# Altium project mainboard.PrjPcb
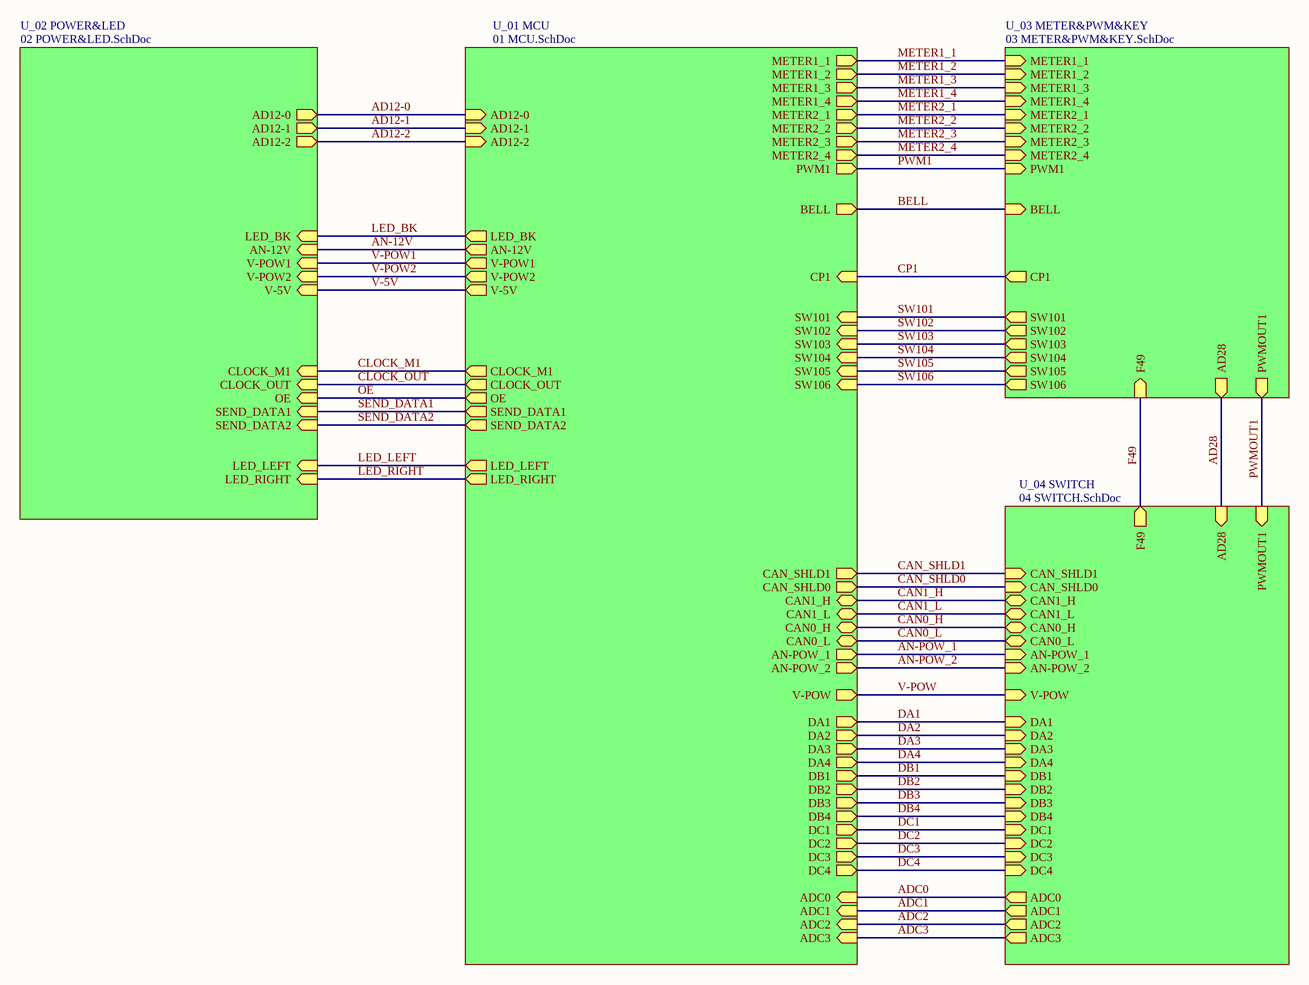
[diagram p0: SCH-MB202-00.SchDoc]
5 sheets, 493 parts. Net scope: hierarchical (ports join the sheet entries above them; power ports are global).
Board files: PCB-MB202-00.PcbDoc, PCB1.PcbDoc
Sheets:
  SCH-MB202-00.SchDoc
    U_01 MCU = 01 MCU.SchDoc
    U_03 METER&PWM&KEY = 03 METER&PWM&KEY.SchDoc
    U_04 SWITCH = 04 SWITCH.SchDoc
    U_02 POWER&LED = 02 POWER&LED.SchDoc

## Sheet SCH-MB202-00.SchDoc
size A3

### Sub-sheets
U_01 MCU = 01 MCU.SchDoc: METER1_1 (out), METER1_2 (out), METER1_3 (out), METER1_4 (out), METER2_1 (out), METER2_2 (out), METER2_3 (out), METER2_4 (out), SW101 (in), SW102 (in), SW103 (in), SW104 (in), CP1 (in), DA1 (out), DA2 (out), DA3 (out), DA4 (out), DB1 (out), DB2 (out), DB3 (out), DB4 (out), DC1 (out), DC2 (out), DC3 (out), DC4 (out), ADC0 (in), ADC1 (in), ADC2 (in), ADC3 (in), LED_BK (out), PWM1 (out), V-POW (out), AN-POW_1 (out), V-5V (out), CAN_SHLD1 (out), CAN1_H (bidir), CAN1_L (bidir), CAN_SHLD0 (out), CAN0_H (bidir), CAN0_L (bidir), V-POW1 (out), V-POW2 (out), AD12-1 (in), AD12-2 (in), AN-12V (out), AN-POW_2 (out), AD12-0 (in), CLOCK_M1 (out), CLOCK_OUT (out), SEND_DATA1 (out), OE (out), SEND_DATA2 (out), BELL (out), LED_RIGHT (out), LED_LEFT (out), SW105 (in), SW106 (in)
U_02 POWER&LED = 02 POWER&LED.SchDoc: LED_BK (in), AD12-0 (out), AN-12V (in), AD12-1 (out), V-POW1 (in), AD12-2 (out), V-POW2 (in), V-5V (in), CLOCK_M1 (in), CLOCK_OUT (in), SEND_DATA1 (in), OE (in), SEND_DATA2 (in), LED_LEFT (in), LED_RIGHT (in)
U_03 METER&PWM&KEY = 03 METER&PWM&KEY.SchDoc: METER1_1 (in), METER1_2 (in), METER1_3 (in), METER1_4 (in), METER2_1 (in), METER2_2 (in), METER2_3 (in), METER2_4 (in), SW101 (out), SW102 (out), SW103 (out), SW104 (out), PWM1 (in), PWMOUT1 (out), AD28 (out), CP1 (out), F49 (in), BELL (in), SW105 (out), SW106 (out)
U_04 SWITCH = 04 SWITCH.SchDoc: F49 (out), PWMOUT1 (in), CAN0_H (bidir), CAN_SHLD0 (in), CAN0_L (bidir), CAN1_L (bidir), CAN1_H (bidir), CAN_SHLD1 (in), AN-POW_1 (in), AN-POW_2 (in), V-POW (in), ADC0 (out), ADC1 (out), ADC2 (out), ADC3 (out), DA1 (in), DA2 (in), DA3 (in), DA4 (in), DB1 (in), DB2 (in), DB3 (in), DB4 (in), DC1 (in), DC2 (in), DC3 (in), DC4 (in), AD28 (in)

### Nets
AD12-0: sheet U_01 MCU/AD12-0, sheet U_02 POWER&LED/AD12-0
AD12-1: sheet U_01 MCU/AD12-1, sheet U_02 POWER&LED/AD12-1
AD12-2: sheet U_01 MCU/AD12-2, sheet U_02 POWER&LED/AD12-2
AD28: sheet U_03 METER&PWM&KEY/AD28, sheet U_04 SWITCH/AD28
ADC0: sheet U_01 MCU/ADC0, sheet U_04 SWITCH/ADC0
ADC1: sheet U_01 MCU/ADC1, sheet U_04 SWITCH/ADC1
ADC2: sheet U_01 MCU/ADC2, sheet U_04 SWITCH/ADC2
ADC3: sheet U_01 MCU/ADC3, sheet U_04 SWITCH/ADC3
AN-12V: sheet U_01 MCU/AN-12V, sheet U_02 POWER&LED/AN-12V
AN-POW_1: sheet U_01 MCU/AN-POW_1, sheet U_04 SWITCH/AN-POW_1
AN-POW_2: sheet U_01 MCU/AN-POW_2, sheet U_04 SWITCH/AN-POW_2
BELL: sheet U_01 MCU/BELL, sheet U_03 METER&PWM&KEY/BELL
CAN0_H: sheet U_01 MCU/CAN0_H, sheet U_04 SWITCH/CAN0_H
CAN0_L: sheet U_01 MCU/CAN0_L, sheet U_04 SWITCH/CAN0_L
CAN1_H: sheet U_01 MCU/CAN1_H, sheet U_04 SWITCH/CAN1_H
CAN1_L: sheet U_01 MCU/CAN1_L, sheet U_04 SWITCH/CAN1_L
CAN_SHLD0: sheet U_01 MCU/CAN_SHLD0, sheet U_04 SWITCH/CAN_SHLD0
CAN_SHLD1: sheet U_01 MCU/CAN_SHLD1, sheet U_04 SWITCH/CAN_SHLD1
CLOCK_M1: sheet U_01 MCU/CLOCK_M1, sheet U_02 POWER&LED/CLOCK_M1
CLOCK_OUT: sheet U_01 MCU/CLOCK_OUT, sheet U_02 POWER&LED/CLOCK_OUT
CP1: sheet U_01 MCU/CP1, sheet U_03 METER&PWM&KEY/CP1
DA1: sheet U_01 MCU/DA1, sheet U_04 SWITCH/DA1
DA2: sheet U_01 MCU/DA2, sheet U_04 SWITCH/DA2
DA3: sheet U_01 MCU/DA3, sheet U_04 SWITCH/DA3
DA4: sheet U_01 MCU/DA4, sheet U_04 SWITCH/DA4
DB1: sheet U_01 MCU/DB1, sheet U_04 SWITCH/DB1
DB2: sheet U_01 MCU/DB2, sheet U_04 SWITCH/DB2
DB3: sheet U_01 MCU/DB3, sheet U_04 SWITCH/DB3
DB4: sheet U_01 MCU/DB4, sheet U_04 SWITCH/DB4
DC1: sheet U_01 MCU/DC1, sheet U_04 SWITCH/DC1
DC2: sheet U_01 MCU/DC2, sheet U_04 SWITCH/DC2
DC3: sheet U_01 MCU/DC3, sheet U_04 SWITCH/DC3
DC4: sheet U_01 MCU/DC4, sheet U_04 SWITCH/DC4
F49: sheet U_03 METER&PWM&KEY/F49, sheet U_04 SWITCH/F49
LED_BK: sheet U_01 MCU/LED_BK, sheet U_02 POWER&LED/LED_BK
LED_LEFT: sheet U_01 MCU/LED_LEFT, sheet U_02 POWER&LED/LED_LEFT
LED_RIGHT: sheet U_01 MCU/LED_RIGHT, sheet U_02 POWER&LED/LED_RIGHT
METER1_1: sheet U_01 MCU/METER1_1, sheet U_03 METER&PWM&KEY/METER1_1
METER1_2: sheet U_01 MCU/METER1_2, sheet U_03 METER&PWM&KEY/METER1_2
METER1_3: sheet U_01 MCU/METER1_3, sheet U_03 METER&PWM&KEY/METER1_3
METER1_4: sheet U_01 MCU/METER1_4, sheet U_03 METER&PWM&KEY/METER1_4
METER2_1: sheet U_01 MCU/METER2_1, sheet U_03 METER&PWM&KEY/METER2_1
METER2_2: sheet U_01 MCU/METER2_2, sheet U_03 METER&PWM&KEY/METER2_2
METER2_3: sheet U_01 MCU/METER2_3, sheet U_03 METER&PWM&KEY/METER2_3
METER2_4: sheet U_01 MCU/METER2_4, sheet U_03 METER&PWM&KEY/METER2_4
OE: sheet U_01 MCU/OE, sheet U_02 POWER&LED/OE
PWM1: sheet U_01 MCU/PWM1, sheet U_03 METER&PWM&KEY/PWM1
PWMOUT1: sheet U_03 METER&PWM&KEY/PWMOUT1, sheet U_04 SWITCH/PWMOUT1
SEND_DATA1: sheet U_01 MCU/SEND_DATA1, sheet U_02 POWER&LED/SEND_DATA1
SEND_DATA2: sheet U_01 MCU/SEND_DATA2, sheet U_02 POWER&LED/SEND_DATA2
SW101: sheet U_01 MCU/SW101, sheet U_03 METER&PWM&KEY/SW101
SW102: sheet U_01 MCU/SW102, sheet U_03 METER&PWM&KEY/SW102
SW103: sheet U_01 MCU/SW103, sheet U_03 METER&PWM&KEY/SW103
SW104: sheet U_01 MCU/SW104, sheet U_03 METER&PWM&KEY/SW104
SW105: sheet U_01 MCU/SW105, sheet U_03 METER&PWM&KEY/SW105
SW106: sheet U_01 MCU/SW106, sheet U_03 METER&PWM&KEY/SW106
V-5V: sheet U_01 MCU/V-5V, sheet U_02 POWER&LED/V-5V
V-POW: sheet U_01 MCU/V-POW, sheet U_04 SWITCH/V-POW
V-POW1: sheet U_01 MCU/V-POW1, sheet U_02 POWER&LED/V-POW1
V-POW2: sheet U_01 MCU/V-POW2, sheet U_02 POWER&LED/V-POW2

## Sheet 01 MCU.SchDoc
size A3
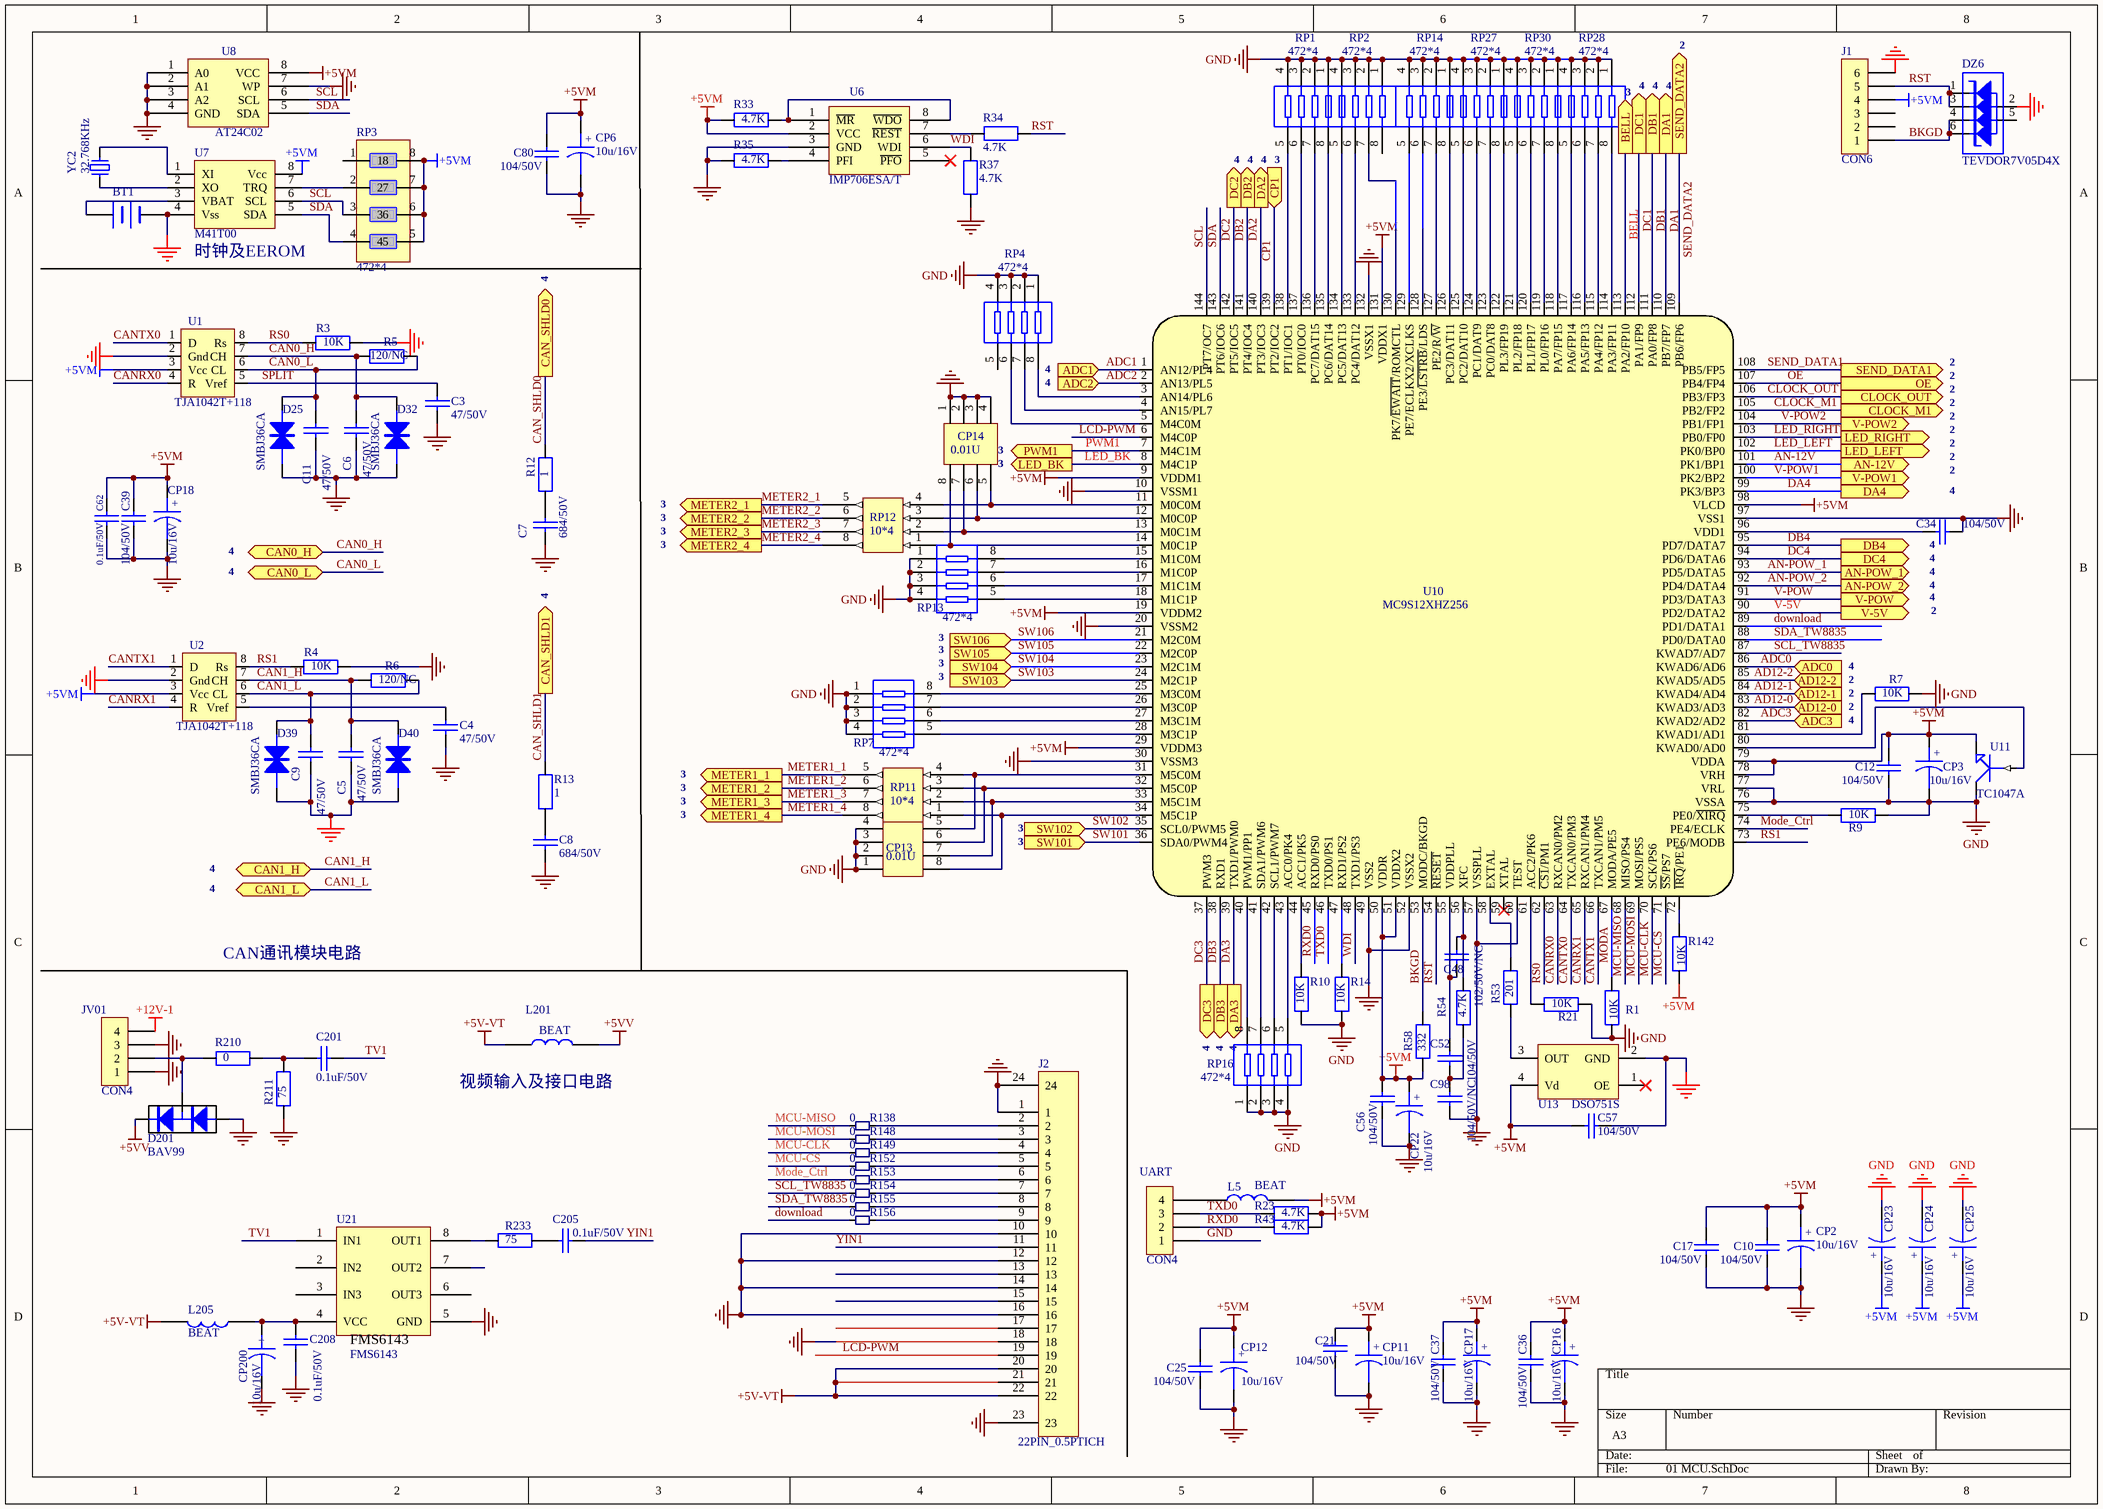
[diagram p1: 01 MCU.SchDoc]

### Parts
BT1  (no value)  [Battery 3]
C3  47/50V  [CR0805]
C4  47/50V  [CR0805]
C5  47/50V  [CR0805]
C6  47/50V  [CR0805]
C7  684/50V  [CR1206]
C8  684/50V  [CR1206]
C9  47/50V  [CR0805]
C10  104/50V  [CR0805]
C11  47/50V  [CR0805]
C12  104/50V  [CR0805]
C17  104/50V  [CR0805]
C21  104/50V  [CR0805]
C25  104/50V  [CR0805]
C34  104/50V  [CR0805]
C36  104/50V  [CR0805]
C37  104/50V  [CR0805]
C39  104/50V  [CR0805]
C48  102/50V/NC  [CR0805]
C52  104/50V  [CR0805]
C56  104/50V  [CR0805]
C57  104/50V  [CR0805]
C62  0.1uF/50V  [CR0805]
C80  104/50V  [CR0805]
C98  104/50V/NC  [CR0805]
C201  0.1uF/50V  [CR0805]
C205  0.1uF/50V  [CR0805]
C208  0.1uF/50V  [CR0805]
CP2  10u/16V  [CE1206]
CP3  10u/16V  [CE1206]
CP6  10u/16V  [CE1206]
CP11  10u/16V  [CE1206]
CP12  10u/16V  [CE1206]
CP13  0.01U  [C4]
CP14  0.01U  [C4]
CP16  10u/16V  [CE1206]
CP17  10u/16V  [CE1206]
CP18  10u/16V  [CE1206]
CP22  10u/16V  [CE1206]
CP23  10u/16V  [CE1206]
CP24  10u/16V  [CE1206]
CP25  10u/16V  [CE1206]
CP200  10u/16V  [CE1206]
D25  SMBJ36CA  [SMB-D]
D32  SMBJ36CA  [SMB-D]
D39  SMBJ36CA  [SMB-D]
D40  SMBJ36CA  [SMB-D]
D201  BAV99  [SOT23]
DZ6  TEVDOR7V05D4X  [SOT-457]
J1  CON6  [DIP 2X3 2.54mm]
J2  22PIN_0.5PTICH  [FPC-22P]
JV01  CON4  [DIP 1X4 2.5mm]
L5  BEAT  [CR0805]
L201  BEAT  [CR0805]
L205  BEAT  [CR0805]
R1  10K  [cr0805]
R3  10K  [CR0805]
R4  10K  [CR0805]
R5  120/NC  [CR0805]
R6  120/NC  [CR0805]
R7  10K  [cr0805]
R9  10K  [CR0805]
R10  10K  [cr0805]
R12  1  [CR0805]
R13  1  [CR0805]
R14  10K  [cr0805]
R21  10K  [cr0805]
R23  4.7K  [CR0805]
R33  4.7K  [CR0805]
R34  4.7K  [CR0805]
R35  4.7K  [CR0805]
R37  4.7K  [CR0805]
R43  4.7K  [CR0805]
R53  201  [CR0805]
R54  4.7K  [CR0805]
R58  332  [CR0805]
R138  0  [CR0805]
R142  10K  [cr0805]
R148  0  [CR0805]
R149  0  [CR0805]
R152  0  [CR0805]
R153  0  [CR0805]
R154  0  [CR0805]
R155  0  [CR0805]
R156  0  [CR0805]
R210  0  [CR0805]
R211  75  [CR0805]
R233  75  [CR0805]
RP1  472*4  [R4]
RP2  472*4  [R4]
RP3  472*4  [R4]
RP4  472*4  [R4]
RP7  472*4  [R4]
RP11  10*4  [R4]
RP12  10*4  [R4]
RP13  472*4  [R4]
RP14  472*4  [R4]
RP16  472*4  [R4]
RP27  472*4  [R4]
RP28  472*4  [R4]
RP30  472*4  [R4]
U1  TJA1042T+118  [SO-8]
U2  TJA1042T+118  [SO-8]
U6  IMP706ESA/T  [SO-8]
U7  M41T00  [SO-8]
U8  AT24C02  [SO-8]
U10  MC9S12XHZ256  [LQFP-144]
U11  TC1047A  [SOT23]
U13  DSO751S  [SMD-CYC]
U21  FMS6143  [SO-8]
UART  CON4  [DIP 1X4 2.5mm]
YC2  32.768KHz  [SM CYC NX3215SA]

### Ports
AD12-0 (in), AD12-1 (in), AD12-2 (in), ADC0 (in), ADC1 (in), ADC2 (in), ADC3 (in), AN-12V (out), AN-POW_1 (out), AN-POW_2 (out), BELL (out), CAN0_H (bidir), CAN0_L (bidir), CAN1_H (bidir), CAN1_L (bidir), CAN_SHLD0 (out), CAN_SHLD1 (out), CLOCK_M1 (out), CLOCK_OUT (out), CP1 (in), DA1 (out), DA2 (out), DA3 (out), DA4 (out), DB1 (out), DB2 (out), DB3 (out), DB4 (out), DC1 (out), DC2 (out), DC3 (out), DC4 (out), LED_BK (out), LED_LEFT (out), LED_RIGHT (out), METER1_1 (out), METER1_2 (out), METER1_3 (out), METER1_4 (out), METER2_1 (out), METER2_2 (out), METER2_3 (out), METER2_4 (out), OE (out), PWM1 (out), SEND_DATA1 (out), SEND_DATA2 (out), SW101 (in), SW102 (in), SW103 (in), SW104 (in), SW105 (in), SW106 (in), V-5V (out), V-POW1 (out), V-POW2 (out), V-POW (out)

### Nets
+5V-VT: J2.20 J2.21 J2.22 L201.1 L205.1
+5VM: C10.1 C12.1 C17.1 C21.2 C25.1 C36.1 C37.1 C39.2 C56.1 C57.1 C62.1 C80.1 CP2.1 CP3.1 CP6.1 CP11.1 CP12.1 CP16.1 CP17.1 CP18.1 CP22.1 CP23.1 CP24.1 CP25.1 J1.4 L5.2 R23.2 R33.2 R43.2 R58.1 R142.2 RP3.5 RP3.6 RP3.7 RP3.8 U1.3(Vcc) U2.3(Vcc) U6.2(VCC) U7.8(Vcc) U8.8(VCC) U10.9(VDDM1) U10.19(VDDM2) U10.29(VDDM3) U10.50(VDDR) U10.51(VDDX2) U10.78(VRH) U10.79(VDDA) U10.98(VLCD) U10.131(VDDX1) U11.1(E) U13.4(Vd)
+5VV: D201.2 L201.2
+12V-1: JV01.4
GND: BT1.2(-) C3.2 C4.2 C5.1 C6.1 C7.2 C8.2 C9.1 C10.2 C11.1 C12.2 C17.2 C21.1 C25.2 C34.2 C36.2 C37.2 C39.1 C56.2 C57.2 C62.2 C80.2 C98.2 C208.2 CP2.2 CP3.2 CP6.2 CP11.2 CP12.2 CP13.1 CP13.2 CP13.3 CP13.4 CP14.1 CP14.2 CP14.3 CP14.4 CP16.2 CP17.2 CP18.2 CP22.2 CP23.2 CP24.2 CP25.2 CP200.2 D25.1 D32.1 D39.1 D40.1 D201.1 DZ6.2 J1.6 J2.1 J2.10 J2.12 J2.14 J2.16 J2.18 J2.23 J2.24 JV01.1 JV01.3 R1.2 R3.2 R4.2 R7.1 R9.2 R10.1 R14.1 R21.2 R35.2 R37.2 R211.2 RP1.1 RP1.2 RP1.3 RP1.4 RP2.1 RP2.2 RP2.3 RP2.4 RP4.1 RP4.2 RP4.3 RP4.4 RP7.1 RP7.2 RP7.3 RP7.4 RP13.1 RP13.2 RP13.3 RP13.4 RP14.1 RP14.2 RP14.3 RP14.4 RP16.1 RP16.2 RP16.3 RP16.4 RP27.1 RP27.2 RP27.3 RP27.4 RP28.1 RP28.2 RP28.3 RP28.4 RP30.1 RP30.2 RP30.3 RP30.4 U1.2(Gnd) U2.2(Gnd) U6.3(GND) U7.4(Vss) U8.1(A0) U8.2(A1) U8.3(A2) U8.4(GND) U8.7(WP) U10.10(VSSM1) U10.20(VSSM2) U10.30(VSSM3) U10.49(VSS2) U10.52(VSSX2) U10.57(VSSPLL) U10.60(TEST) U10.76(VSSA) U10.77(VRL) U10.97(VSS1) U10.132(VSSX1) U11.3(C) U13.2(GND) U21.5(GND) UART.1
AD12-0: U10.83(KWAD3/AD3) ; port AD12-0
AD12-1: U10.84(KWAD4/AD4) ; port AD12-1
AD12-2: U10.85(KWAD5/AD5) ; port AD12-2
ADC0: U10.86(KWAD6/AD6) ; port ADC0
ADC1: U10.1(AN12/PL4) ; port ADC1
ADC2: U10.2(AN13/PL5) ; port ADC2
ADC3: U10.82(KWAD2/AD2) ; port ADC3
AN-12V: U10.101(PK1/BP1) ; port AN-12V
AN-POW_1: U10.93(PD5/DATA5) ; port AN-POW_1
AN-POW_2: U10.92(PD4/DATA4) ; port AN-POW_2
BELL: U10.113(PA2/FP10) ; port BELL
BKGD: DZ6.4 DZ6.6 J1.1 R58.2 U10.53(MODC/BKGD)
CAN0_H: C6.2 D32.2 R5.2 U1.7(CH) ; port CAN0_H
CAN0_L: C11.2 D25.2 R5.1 U1.6(CL) ; port CAN0_L
CAN1_H: C5.2 D40.2 R6.2 U2.7(CH) ; port CAN1_H
CAN1_L: C9.2 D39.2 R6.1 U2.6(CL) ; port CAN1_L
CAN_SHLD0: R12.2 ; port CAN_SHLD0
CAN_SHLD1: R13.2 ; port CAN_SHLD1
CANRX0: U1.4(R) U10.63(RXCAN0/PM2)
CANRX1: U2.4(R) U10.65(RXCAN1/PM4)
CANTX0: U1.1(D) U10.64(TXCAN0/PM3)
CANTX1: U2.1(D) U10.66(TXCAN1/PM5)
CLOCK_M1: U10.105(PB2/FP2) ; port CLOCK_M1
CLOCK_OUT: U10.106(PB3/FP3) ; port CLOCK_OUT
CP1: U10.139(PT2/IOC2) ; port CP1
DA1: U10.110(PB7/FP7) ; port DA1
DA2: U10.140(PT3/IOC3) ; port DA2
DA3: U10.39(TXD1/PWM0) ; port DA3
DA4: U10.99(PK3/BP3) ; port DA4
DB1: U10.111(PA0/FP8) ; port DB1
DB2: U10.141(PT4/IOC4) ; port DB2
DB3: U10.38(RXD1) ; port DB3
DB4: U10.95(PD7/DATA7) ; port DB4
DC1: U10.112(PA1/FP9) ; port DC1
DC2: U10.142(PT5/IOC5) ; port DC2
DC3: U10.37(PWM3) ; port DC3
DC4: U10.94(PD6/DATA6) ; port DC4
download: R156.2 U10.89(PD1/DATA1)
LCD-PWM: J2.19 U10.6(M4C0P)
LED_BK: U10.8(M4C1P) ; port LED_BK
LED_LEFT: U10.102(PK0/BP0) ; port LED_LEFT
LED_RIGHT: U10.103(PB0/FP0) ; port LED_RIGHT
MCU-CLK: R149.2 U10.70(SCK/PS6)
MCU-CS: R152.2 U10.71(~{SS}/PS7)
MCU-MISO: R138.2 U10.68(MISO/PS4)
MCU-MOSI: R148.2 U10.69(MOSI/PS5)
METER1_1: RP11.5 ; port METER1_1
METER1_2: RP11.6 ; port METER1_2
METER1_3: RP11.7 ; port METER1_3
METER1_4: RP11.8 ; port METER1_4
METER2_1: RP12.5 ; port METER2_1
METER2_2: RP12.6 ; port METER2_2
METER2_3: RP12.7 ; port METER2_3
METER2_4: RP12.8 ; port METER2_4
MODA: R1.1 U10.67(MODA/PE5)
Mode_Ctrl: R153.2 U10.74(PE4/ECLK)
OE: U10.107(PB4/FP4) ; port OE
PWM1: U10.7(M4C1M) ; port PWM1
RS0: R3.1 U1.8(Rs) U10.62(~{CS1}/PM1)
RS1: R4.1 U2.8(Rs) U10.73(PE6/MODB)
RST: DZ6.1 DZ6.3 J1.5 R34.2 U10.54(~{RESET})
RXD0: R43.1 U10.45(RXD0/PS0) UART.2
SCL: RP3.3 U7.6(SCL) U8.6(SCL) U10.144(PT7/OC7)
SCL_TW8835: R154.2 U10.87(KWAD7/AD7)
SDA: RP3.4 U7.5(SDA) U8.5(SDA) U10.143(PT6/IOC6)
SDA_TW8835: R155.2 U10.88(PD0/DATA0)
SEND_DATA1: U10.108(PB5/FP5) ; port SEND_DATA1
SEND_DATA2: U10.109(PB6/FP6) ; port SEND_DATA2
SPLIT: C3.1 U1.5(Vref)
SW101: U10.36(SDA0/PWM4) ; port SW101
SW102: U10.35(SCL0/PWM5) ; port SW102
SW103: U10.24(M2C1P) ; port SW103
SW104: U10.23(M2C1M) ; port SW104
SW105: U10.22(M2C0P) ; port SW105
SW106: U10.21(M2C0M) ; port SW106
TV1: C201.2 U21.1(IN1)
TXD0: R23.1 U10.46(TXD0/PS1) UART.3
V-5V: U10.90(PD2/DATA2) ; port V-5V
V-POW: U10.91(PD3/DATA3) ; port V-POW
V-POW1: U10.100(PK2/BP2) ; port V-POW1
V-POW2: U10.104(PB1/FP1) ; port V-POW2
WDI: R37.1 U6.6(WDI) U10.48(TXD1/PS3)
YIN1: C205.2 J2.11
NetBT1_1: BT1.1(+) U7.3(VBAT)
NetC4_1: C4.1 U2.5(Vref)
NetC7_1: C7.1 R12.1
NetC8_1: C8.1 R13.1
NetC34_1: C34.1 U10.96(VDD1)
NetC48_1: C48.1 R54.1 U10.56(XFC)
NetC48_2: C48.2 C52.1 U10.55(VDDPLL)
NetC52_2: C52.2 C98.1 R54.2
NetC201_1: C201.1 R210.2 R211.1
NetC205_1: C205.1 R233.1
NetC208_1: C208.1 CP200.1 L205.2 U21.4(VCC)
NetCP13_5: CP13.5 RP11.4 U10.31(M5C0M)
NetCP13_6: CP13.6 RP11.3 U10.32(M5C0P)
NetCP13_7: CP13.7 RP11.2 U10.33(M5C1M)
NetCP13_8: CP13.8 RP11.1 U10.34(M5C1P)
NetCP14_5: CP14.5 RP12.4 U10.11(M0C0M)
NetCP14_6: CP14.6 RP12.3 U10.12(M0C0P)
NetCP14_7: CP14.7 RP12.2 U10.13(M0C1M)
NetCP14_8: CP14.8 RP12.1 U10.14(M0C1P)
NetD201_3: D201.3 JV01.2 R210.1
NetJ2_2: J2.2 R138.1
NetJ2_3: J2.3 R148.1
NetJ2_4: J2.4 R149.1
NetJ2_5: J2.5 R152.1
NetJ2_6: J2.6 R153.1
NetJ2_7: J2.7 R154.1
NetJ2_8: J2.8 R155.1
NetJ2_9: J2.9 R156.1
NetL5_1: L5.1 UART.4
NetR7_2: R7.2 U10.81(KWAD1/AD1)
NetR9_1: R9.1 U10.75(PE0/~{XIRQ})
NetR10_2: R10.2 U10.44(ACC1/PK5)
NetR14_2: R14.2 U10.47(RXD1/PS2)
NetR21_1: R21.1 U10.61(ACC2/PK6)
NetR33_1: R33.1 U6.1(~{MR}) U6.8(~{WDO})
NetR34_1: R34.1 U6.7(~{REST})
NetR35_1: R35.1 U6.4(PFI)
NetR53_1: R53.1 U13.3(OUT)
NetR53_2: R53.2 U10.58(EXTAL)
NetR142_1: R142.1 U10.72(~{IRQ}/PE1)
NetR233_2: R233.2 U21.8(OUT1)
NetRP1_5: RP1.5 U10.138(PT1/IOC1)
NetRP1_6: RP1.6 U10.137(PT0/IOC0)
NetRP1_7: RP1.7 U10.136(PC7/DAT15)
NetRP1_8: RP1.8 U10.135(PC6/DAT14)
NetRP2_5: RP2.5 U10.134(PC5/DAT13)
NetRP2_6: RP2.6 U10.133(PC4/DAT12)
NetRP2_7: RP2.7 U10.130(PK7/~{EWAIT}/ROMCTL)
NetRP3_2: RP3.2 U7.7(TRQ)
NetRP4_6: RP4.6 U10.5(M4C0M)
NetRP4_7: RP4.7 U10.4(AN15/PL7)
NetRP4_8: RP4.8 U10.3(AN14/PL6)
NetRP7_5: RP7.5 U10.28(M3C1P)
NetRP7_6: RP7.6 U10.27(M3C1M)
NetRP7_7: RP7.7 U10.26(M3C0P)
NetRP7_8: RP7.8 U10.25(M3C0M)
NetRP13_5: RP13.5 U10.18(M1C1P)
NetRP13_6: RP13.6 U10.17(M1C1M)
NetRP13_7: RP13.7 U10.16(M1C0P)
NetRP13_8: RP13.8 U10.15(M1C0M)
NetRP14_5: RP14.5 U10.129(PE7/ECLKX2/XCLKS)
NetRP14_6: RP14.6 U10.128(PE3/~{LSTRB}/LDS)
NetRP14_7: RP14.7 U10.127(PE2/R/~{W})
NetRP14_8: RP14.8 U10.126(PC3/DAT11)
NetRP16_5: RP16.5 U10.43(ACC0/PK4)
NetRP16_6: RP16.6 U10.42(SCL1/PWM7)
NetRP16_7: RP16.7 U10.41(SDA1/PWM6)
NetRP16_8: RP16.8 U10.40(PWM1/PP1)
NetRP27_5: RP27.5 U10.125(PC2/DAT10)
NetRP27_6: RP27.6 U10.124(PC1/DAT9)
NetRP27_7: RP27.7 U10.123(PC0/DAT8)
NetRP27_8: RP27.8 U10.122(PL3/FP19)
NetRP28_5: RP28.5 U10.117(PA6/FP14)
NetRP28_6: RP28.6 U10.116(PA5/FP13)
NetRP28_7: RP28.7 U10.115(PA4/FP12)
NetRP28_8: RP28.8 U10.114(PA3/FP11)
NetRP30_5: RP30.5 U10.121(PL2/FP18)
NetRP30_6: RP30.6 U10.120(PL1/FP17)
NetRP30_7: RP30.7 U10.119(PL0/FP16)
NetRP30_8: RP30.8 U10.118(PA7/FP15)
NetU7_1: U7.1(XI) YC2.2
NetU7_2: U7.2(XO) YC2.1
NetU10_80: U10.80(KWAD0/AD0) U11.2(B)

Not connected (* = marked no-connect by the designer): DZ6 5; J1 2 3; J2 13 15 17; RP2 8; RP3 1; RP4 5; U6 5(~{PFO})*; U10 59(XTAL)*; U13 1(OE)*; U21 2(IN2) 3(IN3) 6(OUT3) 7(OUT2)

### Notes on the sheet
- 2
- (near RP28) 3
- (near RP28) 4
- 4
- (near RP1) 4
- (near RP1) 3
- (near U7) 时钟及EEROM
- (near RP4) 4
- (near CP14) 3
- 3
- (near C34) 4
- (near RP7) 3
- (near R7) 2
- (near R7) 4
- CAN通讯模块电路
- (near RP16) 4
- (near L201) 视频输入及接口电路
- (in symbol CAPACITOR POL) +

### Library data of the parts
BT1 = BATTERY
C3-C12 C17 C21 C25 C34 C36 C37 C39 C48 C52 C56 C57 C62 C80 C98 C208 = CAP: Capacitor
C201 C205 = CAP: 贴片电容
CP2 CP3 CP6 CP11 CP12 CP16-CP18 CP22-CP25 CP200 = CAPACITOR POL: Capacitor
CP13 CP14 = RC_ARRAY
D25 D32 D39 D40 = TVS
D201 = BAV23S: 双二极管
DZ6 = BZA456G: 二极管排
J1 = CON6: Connector
JV01 UART = CON4: Connector
R1 R3-R7 R9 R10 R12-R14 R21 R23 R33-R35 R37 R43 R53 R54 R58 R142 R210 R211 R233 = RES: 贴片电阻
R138 R148 R149 R152-R156 = Resister mini: 贴片电阻
RP1 RP2 RP4 RP7 RP13 RP14 RP16 RP27 RP28 RP30 = R_LINE4: 贴片排阻
RP3 = R_ARRAY
RP11 RP12 = R_PAI
U1 U2 = SN65HVD251
U6 = IMP706
U7 = M41T00: IC
U8 = AT24C02: IC
U11 = DTC143
U13 = POW_CRY
U21 = FMS6143: IC-视频滤波
YC2 = CRYSTAL0

## Sheet 03 METER&PWM&KEY.SchDoc
size A3
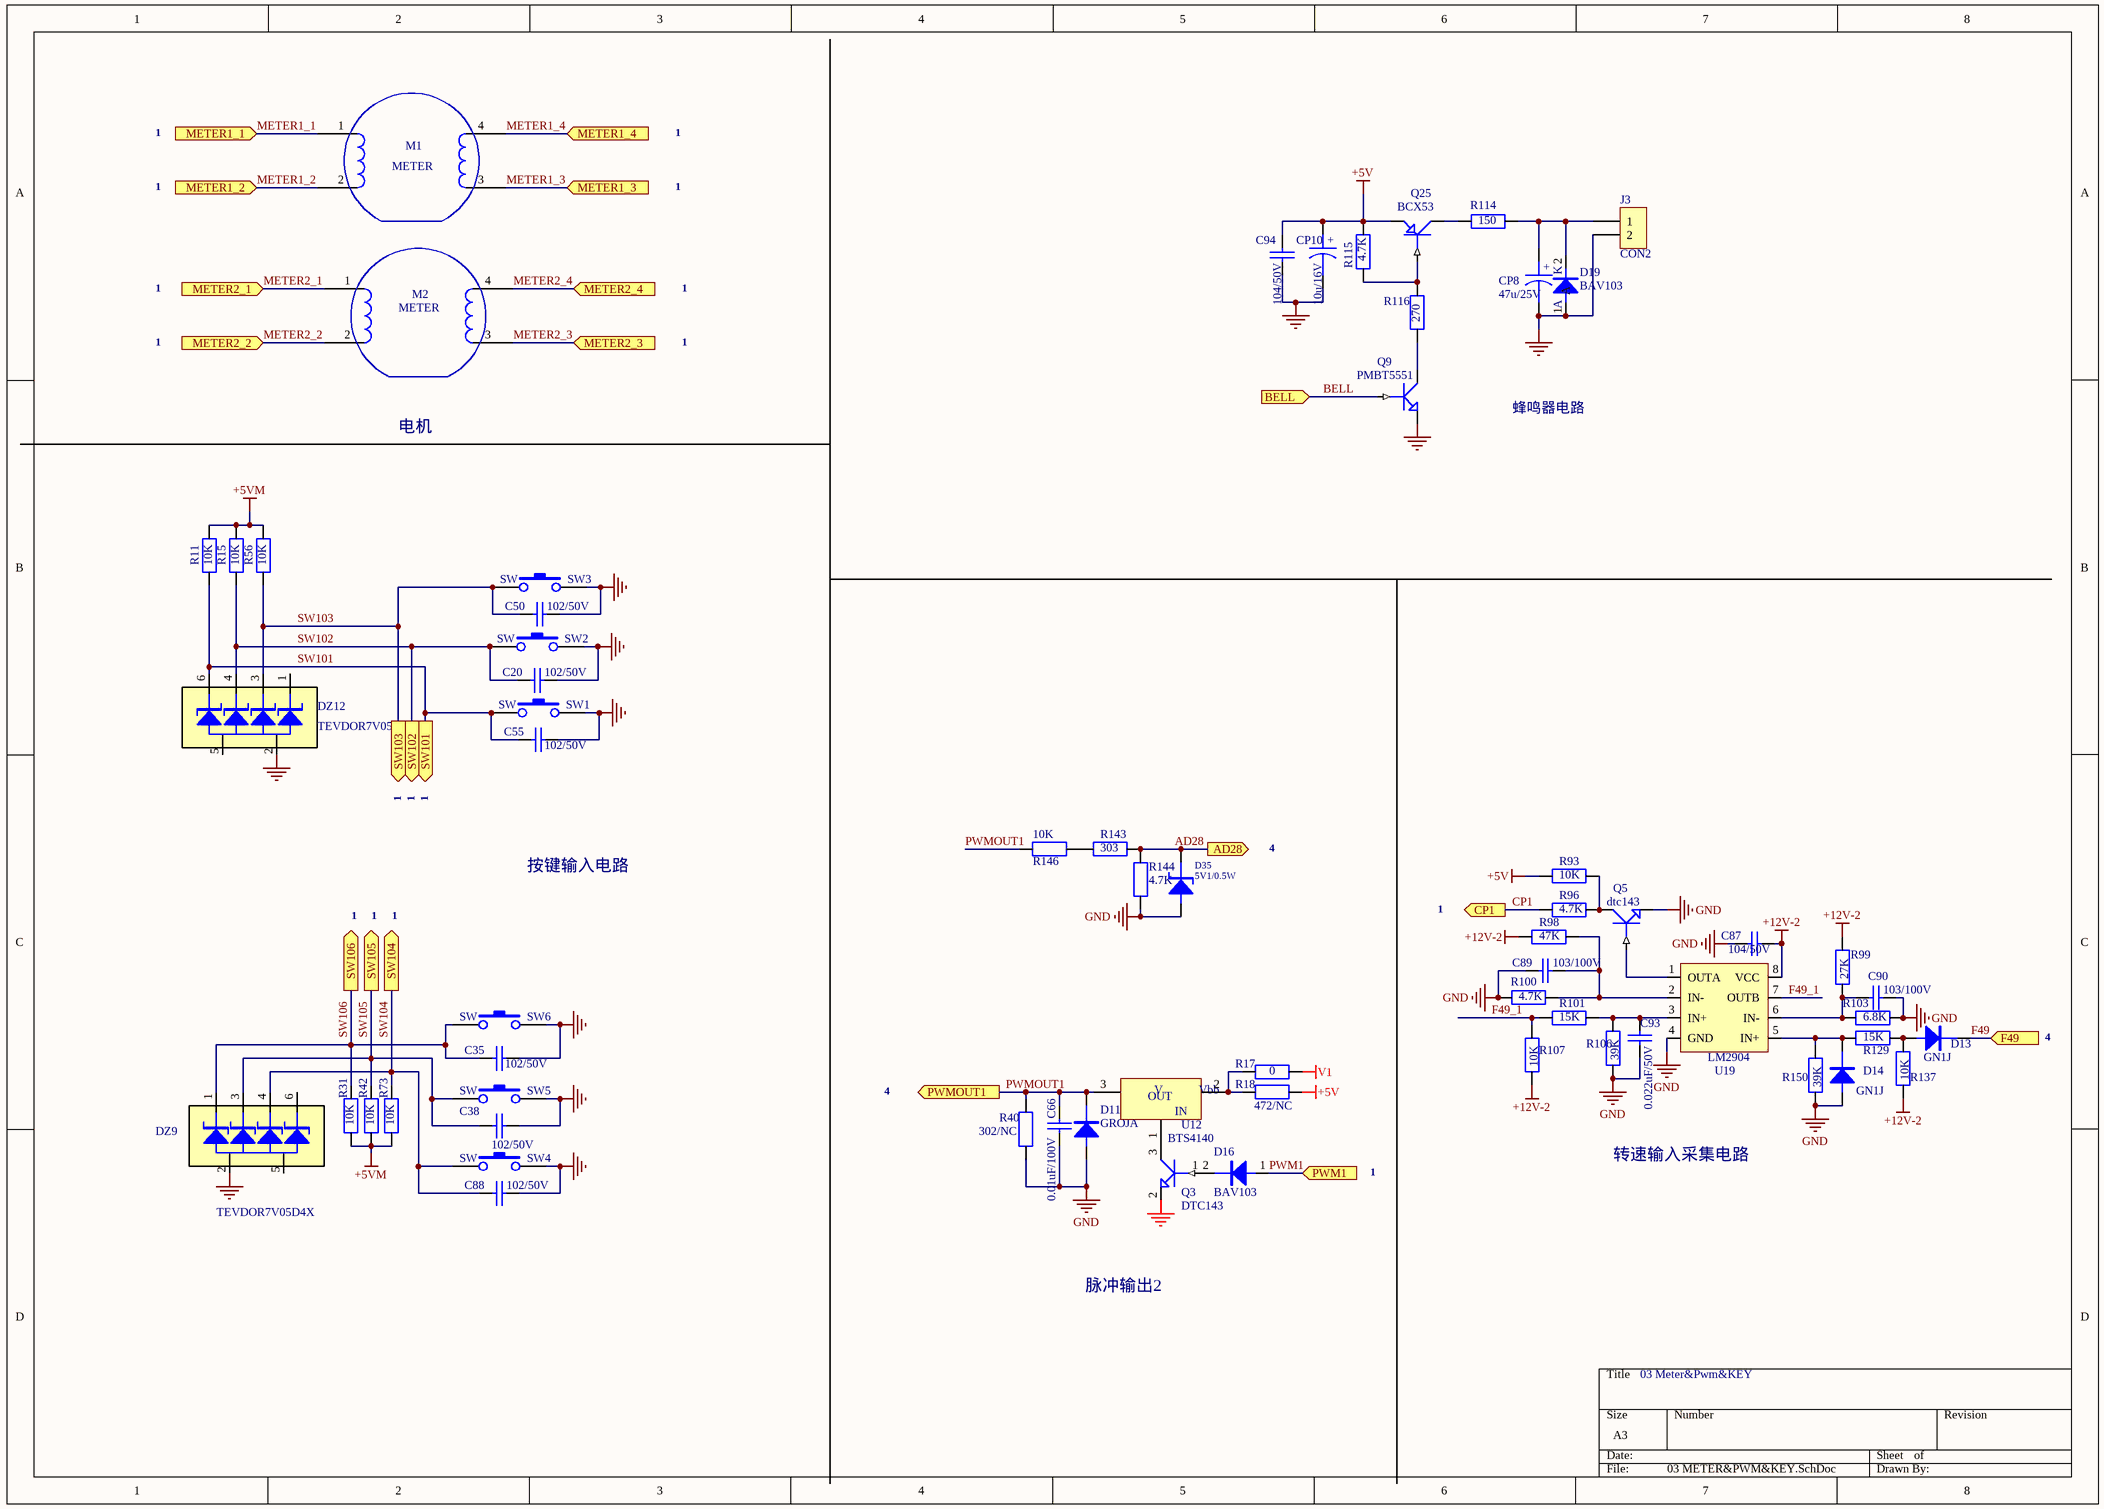
[diagram p2: 03 METER&PWM&KEY.SchDoc]

### Parts
C20  102/50V  [CR0805]
C35  102/50V  [CR0805]
C38  102/50V  [CR0805]
C50  102/50V  [CR0805]
C55  102/50V  [CR0805]
C66  0.01uF/100V  [CR0805]
C87  104/50V  [CR0805]
C88  102/50V  [CR0805]
C89  103/100V  [CR0805]
C90  103/100V  [CR0805]
C93  0.022uF/50V  [CR0805]
C94  104/50V  [CR0805]
CP8  47u/25V  [10uF/25V]
CP10  10u/16V  [CE1206]
D11  GROJA  [SMA]
D13  GN1J  [SMA]
D14  GN1J  [SMA]
D16  BAV103  [SOD-80C]
D19  BAV103  [SOD-80C]
D35  5V1/0.5W  [SOD-80C]
DZ9  TEVDOR7V05D4X  [SOT-457]
DZ12  TEVDOR7V05D4X  [SOT-457]
J3  CON2  [DIP 1X2 2.5mm]
M1  METER  [METER2]
M2  METER  [METER2]
Q3  DTC143  [SOT23]
Q5  dtc143  [SOT-23]
Q9  PMBT5551  [SMT3]
Q25  BCX53  [SOT89]
R11  10K  [CR0805]
R15  10K  [CR0805]
R17  0  [CR1206]
R18  472/NC  [CR1206]
R31  10K  [CR0805]
R40  302/NC  [CR0805]
R42  10K  [CR0805]
R56  10K  [CR0805]
R73  10K  [CR0805]
R93  10K  [CR0805]
R96  4.7K  [CR0805]
R98  47K  [CR0805]
R99  27K  [CR0805]
R100  4.7K  [CR0805]
R101  15K  [CR0805]
R103  6.8K  [CR0805]
R106  39K  [CR0805]
R107  10K  [CR0805]
R114  150  [CR0805]
R115  4.7K  [CR0805]
R116  270  [CR0805]
R129  15K  [CR0805]
R137  10K  [CR0805]
R143  303  [CR0805]
R144  4.7K  [CR0805]
R146  10K  [CR1206]
R150  39K  [CR0805]
SW1  SW  [Switch-1]
SW2  SW  [Switch-1]
SW3  SW  [Switch-1]
SW4  SW  [Switch-1]
SW5  SW  [Switch-1]
SW6  SW  [Switch-1]
U12  BTS4140  [SOT-223]
U19  LM2904  [SO-8]

### Ports
AD28 (out), BELL (in), CP1 (out), F49 (in), METER1_1 (in), METER1_2 (in), METER1_3 (in), METER1_4 (in), METER2_1 (in), METER2_2 (in), METER2_3 (in), METER2_4 (in), PWM1 (in), PWMOUT1 (out), SW101 (out), SW102 (out), SW103 (out), SW104 (out), SW105 (out), SW106 (out)

### Nets
+5V: C94.2 CP10.1 Q25.3(E) R18.2 R93.2 R115.1
+5VM: R11.1 R15.1 R31.2 R42.2 R56.1 R73.2
+12V-2: C87.2 R98.1 R99.2 R107.1 R137.1 U19.8(VCC)
GND: C20.1 C35.1 C38.2 C50.1 C55.1 C66.2 C87.1 C88.1 C89.2 C90.2 C93.1 C94.1 CP8.2 CP10.2 D11.1(A) D14.1(A) D19.1(A) D35.2(K) DZ9.2 DZ12.2 J3.2 Q3.2(gnd) Q5.3(E) Q9.1(E) R40.1 R100.2 R103.2 R106.1 R144.1 R150.1 SW1.2 SW2.2 SW3.2 SW4.2 SW5.2 SW6.2 U19.4(GND)
V1: R17.2
AD28: D35.1(A) R143.2 R144.2 ; port AD28
BELL: Q9.2(B) ; port BELL
CP1: R96.2 ; port CP1
F49: D13.2(K) ; port F49
F49_1: R101.1 R107.2 U19.7(OUTB)
METER1_1: M1.1 ; port METER1_1
METER1_2: M1.2 ; port METER1_2
METER1_3: M1.3 ; port METER1_3
METER1_4: M1.4 ; port METER1_4
METER2_1: M2.1 ; port METER2_1
METER2_2: M2.2 ; port METER2_2
METER2_3: M2.3 ; port METER2_3
METER2_4: M2.4 ; port METER2_4
PWM1: D16.1(A) ; port PWM1
PWMOUT1: C66.1 D11.2(K) R40.2 R146.1 U12.3(VOUT) ; port PWMOUT1
SW101: C55.2 DZ12.6 R11.2 SW1.1 ; port SW101
SW102: C20.2 DZ12.4 R15.2 SW2.1 ; port SW102
SW103: C50.2 DZ12.3 R56.2 SW3.1 ; port SW103
SW104: C88.2 DZ9.4 R73.1 SW4.1 ; port SW104
SW105: C38.1 DZ9.3 R42.1 SW5.1 ; port SW105
SW106: C35.2 DZ9.1 R31.1 SW6.1 ; port SW106
NetC89_1: C89.1 R98.2 R100.1 U19.2(IN-)
NetC90_1: C90.1 R99.1 R103.1 U19.6(IN-)
NetC93_2: C93.2 R101.2 R106.2 U19.3(IN+)
NetCP8_1: CP8.1 D19.2(K) J3.1 R114.1
NetD13_1: D13.1(A) R129.2 R137.2
NetD14_2: D14.2(K) R129.1 R150.2 U19.5(IN+)
NetD16_2: D16.2(K) Q3.1(in)
NetQ3_3: Q3.3(out) U12.1(IN)
NetQ5_1: Q5.1(B) U19.1(OUTA)
NetQ5_2: Q5.2(C) R93.1 R96.1
NetQ9_3: Q9.3(C) R116.1
NetQ25_1: Q25.1(B) R115.2 R116.2
NetQ25_2: Q25.2(C) R114.2
NetR17_1: R17.1 R18.1 U12.2(Vbb) U12.4(Vbb)
NetR143_1: R143.1 R146.2

Not connected (* = marked no-connect by the designer): DZ9 5 6; DZ12 1 5

### Notes on the sheet
- 1
- 电机
- 蜂鸣器电路
- 4
- 按键输入电路
- 转速输入采集电路
- 脉冲输出2
- 03 Meter&Pwm&KEY
- (in symbol BTS4140) V; OUT
- (in symbol CAPACITOR POL) +

### Library data of the parts
C20 C35 C38 C50 C55 C66 C88 C93 = CAP: Capacitor
C87 C89 C90 C94 = CAP: 贴片电容
CP8 CP10 = CAPACITOR POL: Capacitor
D11 D13 D14 D16 = DIODE: 二极管
D19 = GN1J: 二极管
D35 = DW: 稳压二极管
DZ9 DZ12 = BZA456G: 二极管排
J3 = CON2: 连接器-2PIN
Q3 Q9 = DTC143: NPN; HelpURL: G:\资料\规格书\二三极管\dtc143ee.pdf
Q5 = NPN1: 贴片三极管
Q25 = PNP1: 贴片三极管
R11 R15 R17 R18 R31 R40 R42 R56 R73 R93 R96 R98-R101 R103 R106 R107 R114-R116 R129 R137 R143 R144 R146 R150 = RES: 贴片电阻
SW1-SW6 = SW-PB
U12 = BTS4140: IC-单通道功率开关
U19 = LM2904: IC-双路运放

## Sheet 04 SWITCH.SchDoc
size A3
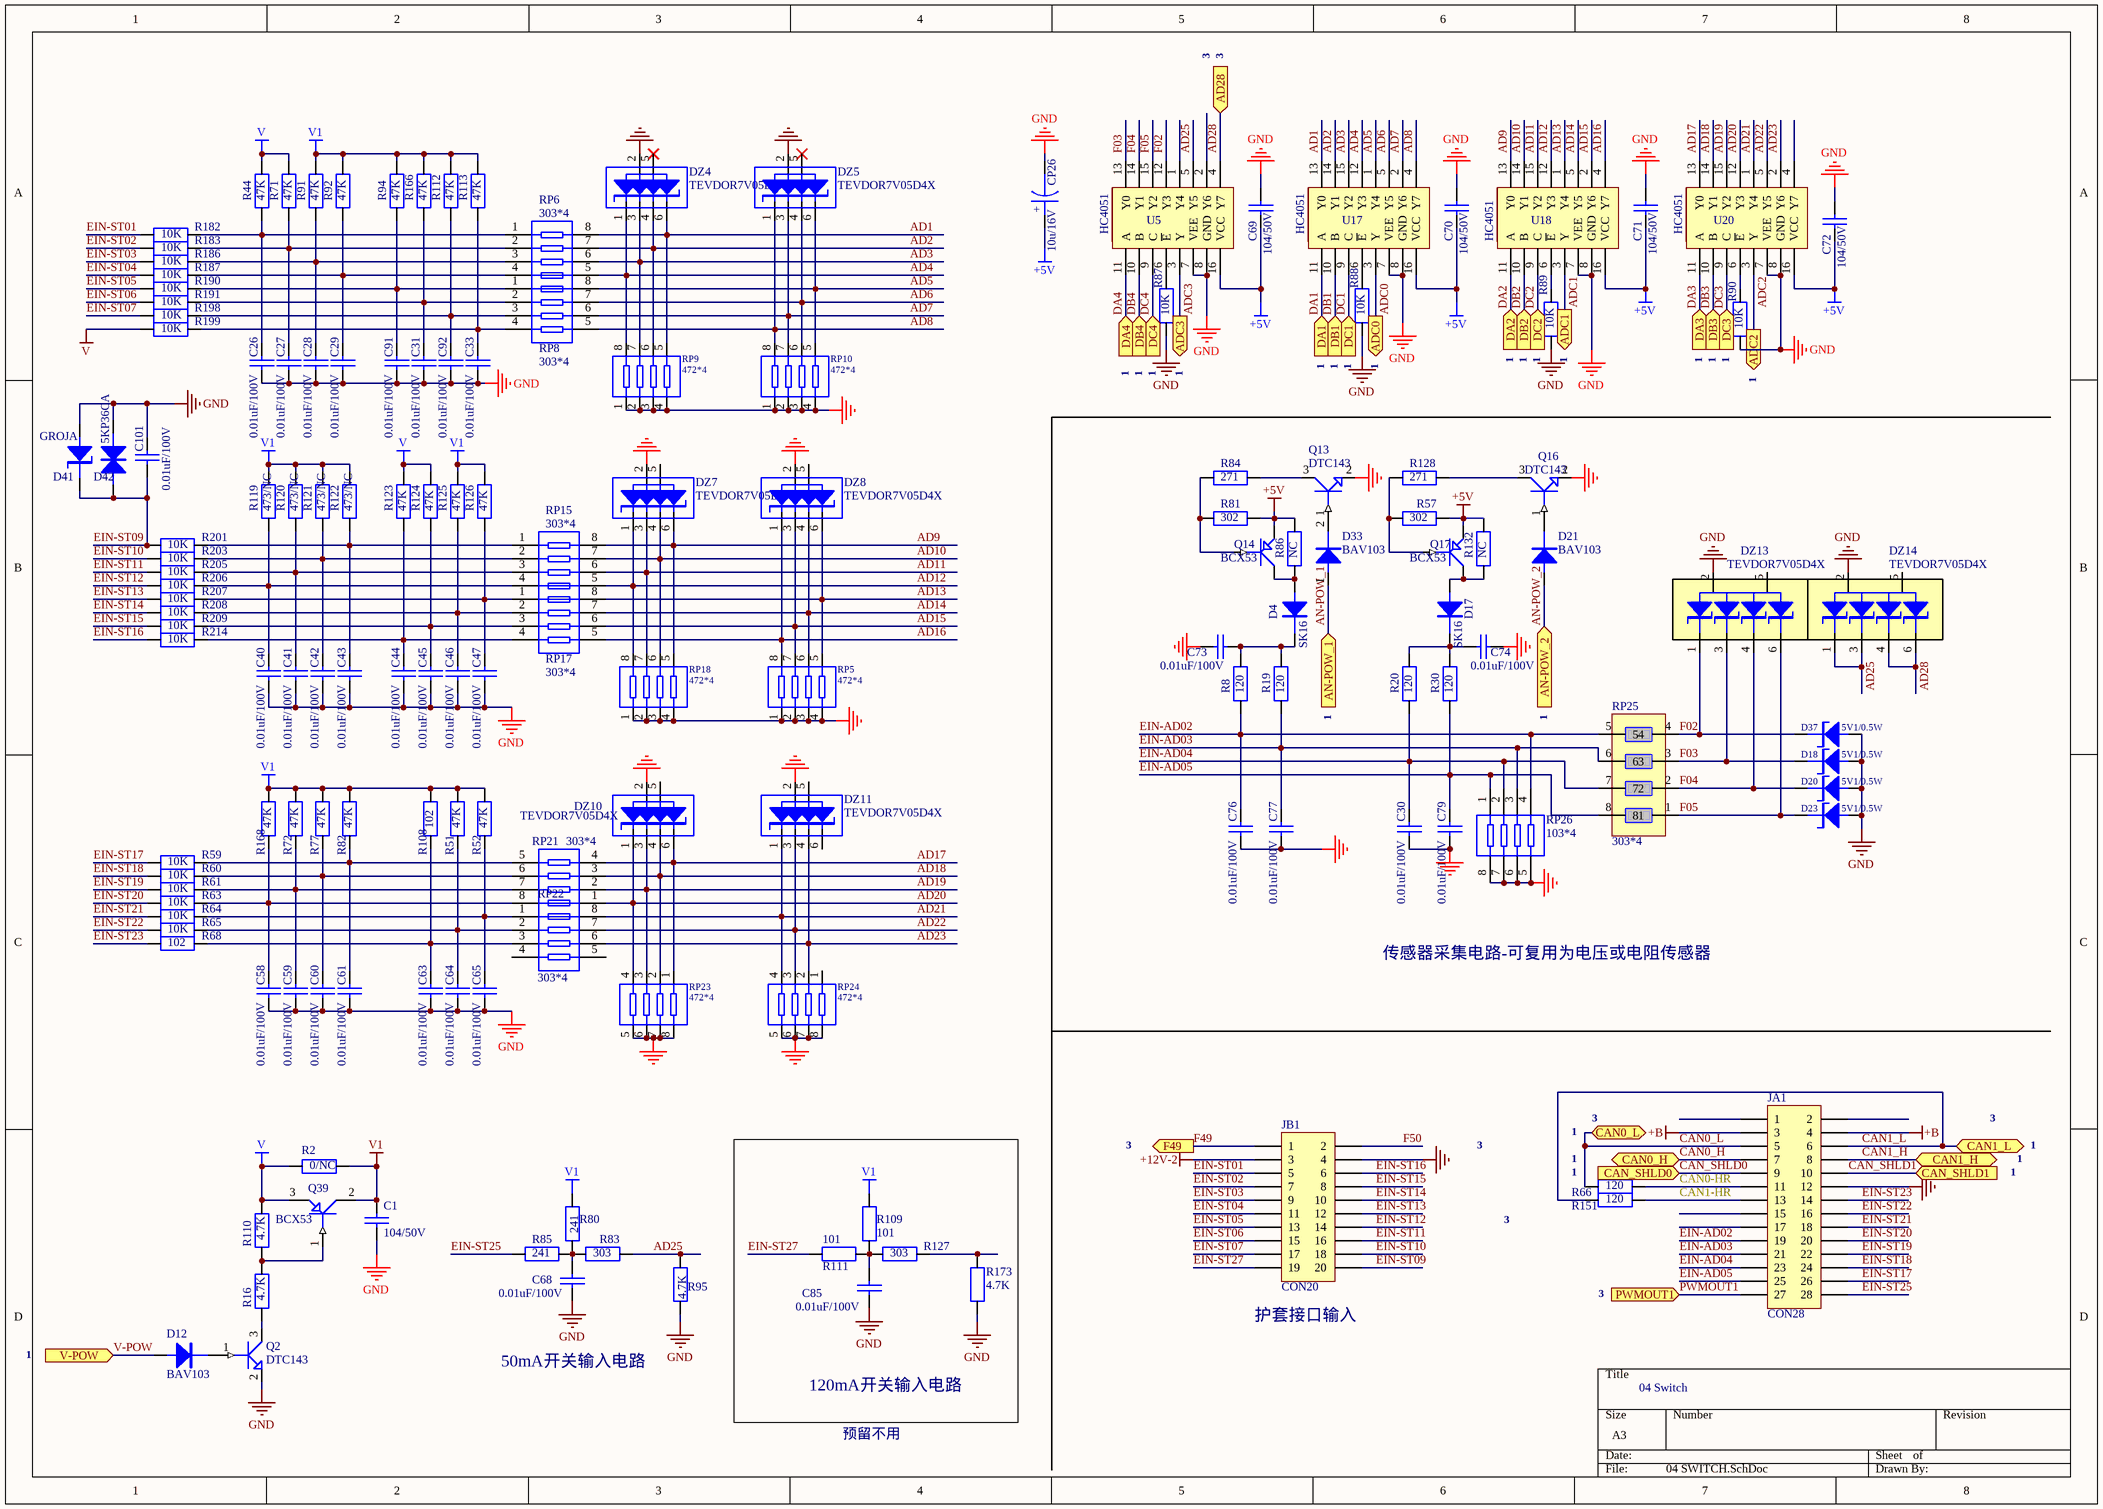
[diagram p3: 04 SWITCH.SchDoc]

### Parts
C1  104/50V  [CR0805]
C26  0.01uF/100V  [CR0805]
C27  0.01uF/100V  [CR0805]
C28  0.01uF/100V  [CR0805]
C29  0.01uF/100V  [CR0805]
C30  0.01uF/100V  [CR0805]
C31  0.01uF/100V  [CR0805]
C33  0.01uF/100V  [CR0805]
C40  0.01uF/100V  [CR0805]
C41  0.01uF/100V  [CR0805]
C42  0.01uF/100V  [CR0805]
C43  0.01uF/100V  [CR0805]
C44  0.01uF/100V  [CR0805]
C45  0.01uF/100V  [CR0805]
C46  0.01uF/100V  [CR0805]
C47  0.01uF/100V  [CR0805]
C58  0.01uF/100V  [CR0805]
C59  0.01uF/100V  [CR0805]
C60  0.01uF/100V  [CR0805]
C61  0.01uF/100V  [CR0805]
C63  0.01uF/100V  [CR0805]
C64  0.01uF/100V  [CR0805]
C65  0.01uF/100V  [CR0805]
C68  0.01uF/100V  [CR0805]
C69  104/50V  [CR0805]
C70  104/50V  [CR0805]
C71  104/50V  [CR0805]
C72  104/50V  [CR0805]
C73  0.01uF/100V  [CR0805]
C74  0.01uF/100V  [CR0805]
C76  0.01uF/100V  [CR0805]
C77  0.01uF/100V  [CR0805]
C79  0.01uF/100V  [CR0805]
C85  0.01uF/100V  [CR0805]
C91  0.01uF/100V  [CR0805]
C92  0.01uF/100V  [CR0805]
C101  0.01uF/100V  [CR0805]
CP26  10u/16V  [CE1206]
D4  SK16  [SMA]
D12  BAV103  [SOD-80C]
D17  SK16  [SMA]
D18  5V1/0.5W  [SOD-80C]
D20  5V1/0.5W  [SOD-80C]
D21  BAV103  [SOD-80C]
D23  5V1/0.5W  [SOD-80C]
D33  BAV103  [SOD-80C]
D37  5V1/0.5W  [SOD-80C]
D41  GROJA  [SMA]
D42  5KP36CA  [SMB-D]
DZ4  TEVDOR7V05D4X  [SOT-457]
DZ5  TEVDOR7V05D4X  [SOT-457]
DZ7  TEVDOR7V05D4X  [SOT-457]
DZ8  TEVDOR7V05D4X  [SOT-457]
DZ10  TEVDOR7V05D4X  [SOT-457]
DZ11  TEVDOR7V05D4X  [SOT-457]
DZ13  TEVDOR7V05D4X  [SOT-457]
DZ14  TEVDOR7V05D4X  [SOT-457]
JA1  CON28  [AMP DIP28]
JB1  CON20  [AMP DIP20]
Q2  DTC143  [SOT23]
Q13  DTC143  [SOT23]
Q14  BCX53  [SOT89]
Q16  DTC143  [SOT23]
Q17  BCX53  [SOT89]
Q39  BCX53  [SOT89]
R2  0/NC  [CR1206]
R8  120  [CR1206]
R16  4.7K  [CR1206]
R19  120  [CR1206]
R20  120  [CR1206]
R30  120  [CR1206]
R44  47K  [CR0805]
R51  47K  [CR0805]
R52  47K  [CR0805]
R57  302  [CR0805]
R59  10K  [CR1206]
R60  10K  [CR1206]
R61  10K  [CR1206]
R63  10K  [CR1206]
R64  10K  [CR1206]
R65  10K  [CR1206]
R66  120  [CR0805]
R68  102  [CR2010]
R71  47K  [CR0805]
R72  47K  [CR0805]
R77  47K  [CR0805]
R80  241  [R-3W]
R81  302  [CR0805]
R82  47K  [CR0805]
R83  303  [CR0805]
R84  271  [CR0805]
R85  241  [R-3W]
R86  NC  [CR1206]
R87  10K  [CR0805]
R88  10K  [CR0805]
R89  10K  [CR0805]
R90  10K  [CR0805]
R91  47K  [CR0805]
R92  47K  [CR0805]
R94  47K  [CR0805]
R95  4.7K  [CR0805]
R108  102  [CR2010]
R109  101  [R-3W]
R110  4.7K  [CR0805]
R111  101  [R-3W]
R112  47K  [CR0805]
R113  47K  [CR0805]
R119  473/NC  [CR0805]
R120  473/NC  [CR0805]
R121  473/NC  [CR0805]
R122  473/NC  [CR0805]
R123  47K  [CR0805]
R124  47K  [CR0805]
R125  47K  [CR0805]
R126  47K  [CR0805]
R127  303  [CR0805]
R128  271  [CR0805]
R132  NC  [CR1206]
R151  120  [CR0805]
R166  47K  [CR0805]
R168  47K  [CR0805]
R173  4.7K  [CR0805]
R182  10K  [CR1206]
R183  10K  [CR1206]
R186  10K  [CR1206]
R187  10K  [CR1206]
R190  10K  [CR1206]
R191  10K  [CR1206]
R198  10K  [CR1206]
R199  10K  [CR1206]
R201  10K  [CR1206]
R203  10K  [CR1206]
R205  10K  [CR1206]
R206  10K  [CR1206]
R207  10K  [CR1206]
R208  10K  [CR1206]
R209  10K  [CR1206]
R214  10K  [CR1206]
RP5  472*4  [R4]
RP6  303*4  [R4]
RP8  303*4  [R4]
RP9  472*4  [R4]
RP10  472*4  [R4]
RP15  303*4  [R4]
RP17  303*4  [R4]
RP18  472*4  [R4]
RP21  303*4  [R4]
RP22  303*4  [R4]
RP23  472*4  [R4]
RP24  472*4  [R4]
RP25  303*4  [R4]
RP26  103*4  [R4]
U5  HC4051  [SO-16]
U17  HC4051  [SO-16]
U18  HC4051  [SO-16]
U20  HC4051  [SO-16]

### Ports
AD28 (in), ADC0 (out), ADC1 (out), ADC2 (out), ADC3 (out), AN-POW_1 (in), AN-POW_2 (in), CAN0_H (bidir), CAN0_L (bidir), CAN1_H (bidir), CAN1_L (bidir), CAN_SHLD0 (in), CAN_SHLD1 (in), DA1 (in), DA2 (in), DA3 (in), DA4 (in), DB1 (in), DB2 (in), DB3 (in), DB4 (in), DC1 (in), DC2 (in), DC3 (in), DC4 (in), F49 (out), PWMOUT1 (in), V-POW (in)

### Nets
+5V: C69.2 C70.2 C71.2 C72.2 CP26.1 Q14.3(E) Q17.3(E) R57.1 R81.1 R86.1 R132.1 U5.16(VCC) U17.16(VCC) U18.16(VCC) U20.16(VCC)
+12V-2: JB1.3
+B: JA1.3 JA1.4
GND: C1.2 C26.2 C27.2 C28.2 C29.2 C30.2 C31.2 C33.2 C40.2 C41.2 C42.2 C43.2 C44.2 C45.2 C46.2 C47.2 C58.2 C59.2 C60.2 C61.2 C63.2 C64.2 C65.2 C68.2 C69.1 C70.1 C71.1 C72.1 C73.1 C74.2 C76.2 C77.2 C79.2 C85.2 C91.2 C92.2 C101.1 CP26.2 D18.1(A) D20.1(A) D23.1(A) D37.1(A) D41.1(A) D42.1 DZ4.2 DZ5.2 DZ7.2 DZ8.2 DZ10.2 DZ11.2 DZ13.2 DZ14.2 JA1.12 JB1.4 Q2.2(gnd) Q13.2(gnd) Q16.2(gnd) R87.2 R88.2 R89.2 R90.2 R95.1 R173.1 RP5.1 RP5.2 RP5.3 RP5.4 RP9.1 RP9.2 RP9.3 RP9.4 RP10.1 RP10.2 RP10.3 RP10.4 RP18.1 RP18.2 RP18.3 RP18.4 RP23.5 RP23.6 RP23.7 RP23.8 RP24.5 RP24.6 RP24.7 RP24.8 RP26.5 RP26.6 RP26.7 RP26.8 U5.7(VEE) U5.8(GND) U17.7(VEE) U17.8(GND) U18.7(VEE) U18.8(GND) U20.7(VEE) U20.8(GND)
V: Q39.3(C) R2.1 R44.2 R71.2 R110.2 R123.2 R124.2 R199.1
V1: C1.1 Q39.2(E) R2.2 R51.2 R52.2 R72.2 R77.2 R80.2 R82.2 R91.2 R92.2 R94.2 R108.2 R109.2 R112.2 R113.2 R119.2 R120.2 R121.2 R122.2 R125.2 R126.2 R166.2 R168.2
AD1: DZ4.6 RP6.8 RP9.5 U17.13(Y0)
AD2: DZ4.4 RP6.7 RP9.6 U17.14(Y1)
AD3: DZ4.3 RP6.6 RP9.7 U17.15(Y2)
AD4: DZ4.1 RP6.5 RP9.8 U17.12(Y3)
AD5: DZ5.6 RP8.8 RP10.5 U17.1(Y4)
AD6: DZ5.4 RP8.7 RP10.6 U17.5(Y5)
AD7: DZ5.3 RP8.6 RP10.7 U17.2(Y6)
AD8: DZ5.1 RP8.5 RP10.8 U17.4(Y7)
AD9: DZ7.6 RP15.8 RP18.5 U18.13(Y0)
AD10: DZ7.4 RP15.7 RP18.6 U18.14(Y1)
AD11: DZ7.3 RP15.6 RP18.7 U18.15(Y2)
AD12: DZ7.1 RP15.5 RP18.8 U18.12(Y3)
AD13: DZ8.6 RP5.5 RP17.8 U18.1(Y4)
AD14: DZ8.4 RP5.6 RP17.7 U18.5(Y5)
AD15: DZ8.3 RP5.7 RP17.6 U18.2(Y6)
AD16: DZ8.1 RP5.8 RP17.5 U18.4(Y7)
AD17: DZ10.6 RP21.4 RP23.1 U20.13(Y0)
AD18: DZ10.4 RP21.3 RP23.2 U20.14(Y1)
AD19: DZ10.3 RP21.2 RP23.3 U20.15(Y2)
AD20: DZ10.1 RP21.1 RP23.4 U20.12(Y3)
AD21: DZ11.1 RP22.8 RP24.4 U20.1(Y4)
AD22: DZ11.3 RP22.7 RP24.3 U20.5(Y5)
AD23: DZ11.4 RP22.6 RP24.2 U20.2(Y6)
AD25: DZ14.1 DZ14.3 R83.2 R95.2 U5.5(Y5)
AD28: DZ14.4 DZ14.6 U5.4(Y7) ; port AD28
ADC0: U17.3(Y) ; port ADC0
ADC1: U18.3(Y) ; port ADC1
ADC2: U20.3(Y) ; port ADC2
ADC3: U5.3(Y) ; port ADC3
AN-POW_1: D33.1(A) ; port AN-POW_1
AN-POW_2: D21.1(A) ; port AN-POW_2
CAN0-HR: JA1.11 R66.2
CAN0_H: JA1.7 ; port CAN0_H
CAN0_L: JA1.5 R66.1 ; port CAN0_L
CAN1-HR: JA1.13 R151.1
CAN1_H: JA1.8 ; port CAN1_H
CAN1_L: JA1.6 R151.2 ; port CAN1_L
CAN_SHLD0: JA1.9 ; port CAN_SHLD0
CAN_SHLD1: JA1.10 ; port CAN_SHLD1
DA1: U17.11(A) ; port DA1
DA2: U18.11(A) ; port DA2
DA3: U20.11(A) ; port DA3
DA4: U5.11(A) ; port DA4
DB1: U17.10(B) ; port DB1
DB2: U18.10(B) ; port DB2
DB3: U20.10(B) ; port DB3
DB4: U5.10(B) ; port DB4
DC1: U17.9(C) ; port DC1
DC2: U18.9(C) ; port DC2
DC3: U20.9(C) ; port DC3
DC4: U5.9(C) ; port DC4
EIN-AD02: C76.1 JA1.19 R8.2 RP25.5 RP26.4
EIN-AD03: C77.1 JA1.21 R19.2 RP25.6 RP26.3
EIN-AD04: C30.1 JA1.23 R20.2 RP25.7 RP26.2
EIN-AD05: C79.1 JA1.25 R30.2 RP25.8 RP26.1
EIN-ST01: JB1.5 R182.1
EIN-ST02: JB1.7 R183.1
EIN-ST03: JB1.9 R186.1
EIN-ST04: JB1.11 R187.1
EIN-ST05: JB1.13 R190.1
EIN-ST06: JB1.15 R191.1
EIN-ST07: JB1.17 R198.1
EIN-ST09: C101.2 D41.2(K) D42.2 JB1.20 R201.1
EIN-ST10: JB1.18 R203.1
EIN-ST11: JB1.16 R205.1
EIN-ST12: JB1.14 R206.1
EIN-ST13: JB1.12 R207.1
EIN-ST14: JB1.10 R208.1
EIN-ST15: JB1.8 R209.1
EIN-ST16: JB1.6 R214.1
EIN-ST17: JA1.26 R59.1
EIN-ST18: JA1.24 R60.1
EIN-ST19: JA1.22 R61.1
EIN-ST20: JA1.20 R63.1
EIN-ST21: JA1.18 R64.1
EIN-ST22: JA1.16 R65.1
EIN-ST23: JA1.14 R68.1
EIN-ST25: JA1.28 R85.1
EIN-ST27: JB1.19 R111.1
F02: D37.2(K) DZ13.1 RP25.4 U5.12(Y3)
F03: D18.2(K) DZ13.3 RP25.3 U5.13(Y0)
F04: D20.2(K) DZ13.4 RP25.2 U5.14(Y1)
F05: D23.2(K) DZ13.6 RP25.1 U5.15(Y2)
F49: JB1.1 ; port F49
F50: JB1.2
PWMOUT1: JA1.27 ; port PWMOUT1
V-POW: D12.1(A) ; port V-POW
NetC26_1: C26.1 R44.1 R182.2 RP6.1
NetC27_1: C27.1 R71.1 R183.2 RP6.2
NetC28_1: C28.1 R91.1 R186.2 RP6.3
NetC29_1: C29.1 R92.1 R187.2 RP6.4
NetC31_1: C31.1 R166.1 R191.2 RP8.2
NetC33_1: C33.1 R113.1 R199.2 RP8.4
NetC40_1: C40.1 R119.1 R206.2 RP15.4
NetC41_1: C41.1 R120.1 R205.2 RP15.3
NetC42_1: C42.1 R121.1 R203.2 RP15.2
NetC43_1: C43.1 R122.1 R201.2 RP15.1
NetC44_1: C44.1 R123.1 R214.2 RP17.4
NetC45_1: C45.1 R124.1 R209.2 RP17.3
NetC46_1: C46.1 R125.1 R208.2 RP17.2
NetC47_1: C47.1 R126.1 R207.2 RP17.1
NetC58_1: C58.1 R63.2 R168.1 RP21.8
NetC59_1: C59.1 R61.2 R72.1 RP21.7
NetC60_1: C60.1 R60.2 R77.1 RP21.6
NetC61_1: C61.1 R59.2 R82.1 RP21.5
NetC63_1: C63.1 R68.2 R108.1 RP22.3
NetC64_1: C64.1 R51.1 R65.2 RP22.2
NetC65_1: C65.1 R52.1 R64.2 RP22.1
NetC68_1: C68.1 R80.1 R83.1 R85.2
NetC73_2: C73.2 D4.2(K) R8.1 R19.1
NetC74_1: C74.1 D17.2(K) R20.1 R30.1
NetC85_1: C85.1 R109.1 R111.2 R127.1
NetC91_1: C91.1 R94.1 R190.2 RP8.1
NetC92_1: C92.1 R112.1 R198.2 RP8.3
NetD4_1: D4.1(A) Q14.2(C) R86.2
NetD12_2: D12.2(K) Q2.1(in)
NetD17_1: D17.1(A) Q17.2(C) R132.2
NetD21_2: D21.2(K) Q16.1(in)
NetD33_2: D33.2(K) Q13.1(in)
NetQ2_3: Q2.3(out) R16.1
NetQ13_3: Q13.3(out) R84.2
NetQ14_1: Q14.1(B) R81.2 R84.1
NetQ16_3: Q16.3(out) R128.1
NetQ17_1: Q17.1(B) R57.2 R128.2
NetQ39_1: Q39.1(B) R16.2 R110.1
NetR87_1: R87.1 U5.6(~{E})
NetR88_1: R88.1 U17.6(~{E})
NetR89_1: R89.1 U18.6(~{E})
NetR90_1: R90.1 U20.6(~{E})
NetR127_2: R127.2 R173.2

Not connected (* = marked no-connect by the designer): DZ4 5*; DZ5 5*; DZ7 5; DZ8 5; DZ10 5; DZ11 5 6; DZ13 5; DZ14 5; JA1 1 2 15 17; RP22 4 5; RP24 1; U5 1(Y4) 2(Y6); U20 4(Y7)

### Notes on the sheet
- 3
- 1
- (near R87) 1
- (near R88) 1
- (near R89) 1
- (near R90) 1
- (near R19) 1
- 传感器采集电路-可复用为电压或电阻传感器
- (near JB1) 护套接口输入
- 50mA开关输入电路
- 120mA开关输入电路
- 04 Switch
- 预留不用
- (in symbol CAPACITOR POL) +

### Library data of the parts
C1 = CAP: 贴片电容
C26-C31 C33 C40-C47 C58-C61 C63-C65 C68-C74 C76 C77 C79 C85 C91 C92 C101 = CAP: Capacitor
CP26 = CAPACITOR POL: Capacitor
D4 D12 D17 D21 D33 = DIODE: 二极管
D18 D20 D23 D37 D41 = DW: 稳压二极管
D42 = TVS
DZ4 DZ5 DZ7 DZ8 DZ10 DZ11 DZ13 DZ14 = BZA456G: 二极管排
Q2 Q13 Q16 = DTC143: NPN; HelpURL: G:\资料\规格书\二三极管\dtc143ee.pdf
Q14 Q17 = PNP1: 贴片三极管
Q39 = BSP631: PNP三极管
R2 R8 R16 R19 R20 R30 R44 R51 R52 R57 R59-R61 R63-R66 R68 R71 R72 R77 R80-R92 R94 R95 R108-R113 R119-R128 R132 R151 R166 R168 R173 R182 R183 R186 R187 R190 R191 R198 R199 R201 R203 R205-R209 R214 = RES: 贴片电阻
RP5 RP9 RP10 RP18 RP23 RP24 = RN: 排阻
RP6 RP8 RP15 RP17 RP21 RP22 = R_LINE4: 贴片排阻
RP25 = R_ARRAY
RP26 = R_LINE4: 排阻
U5 U17 U18 U20 = HC4051: IC-8路模拟开关集成快; HelpURL: G:\资料\规格书\数字逻辑\74HC4051.pdf

## Sheet 02 POWER&LED.SchDoc
size A3
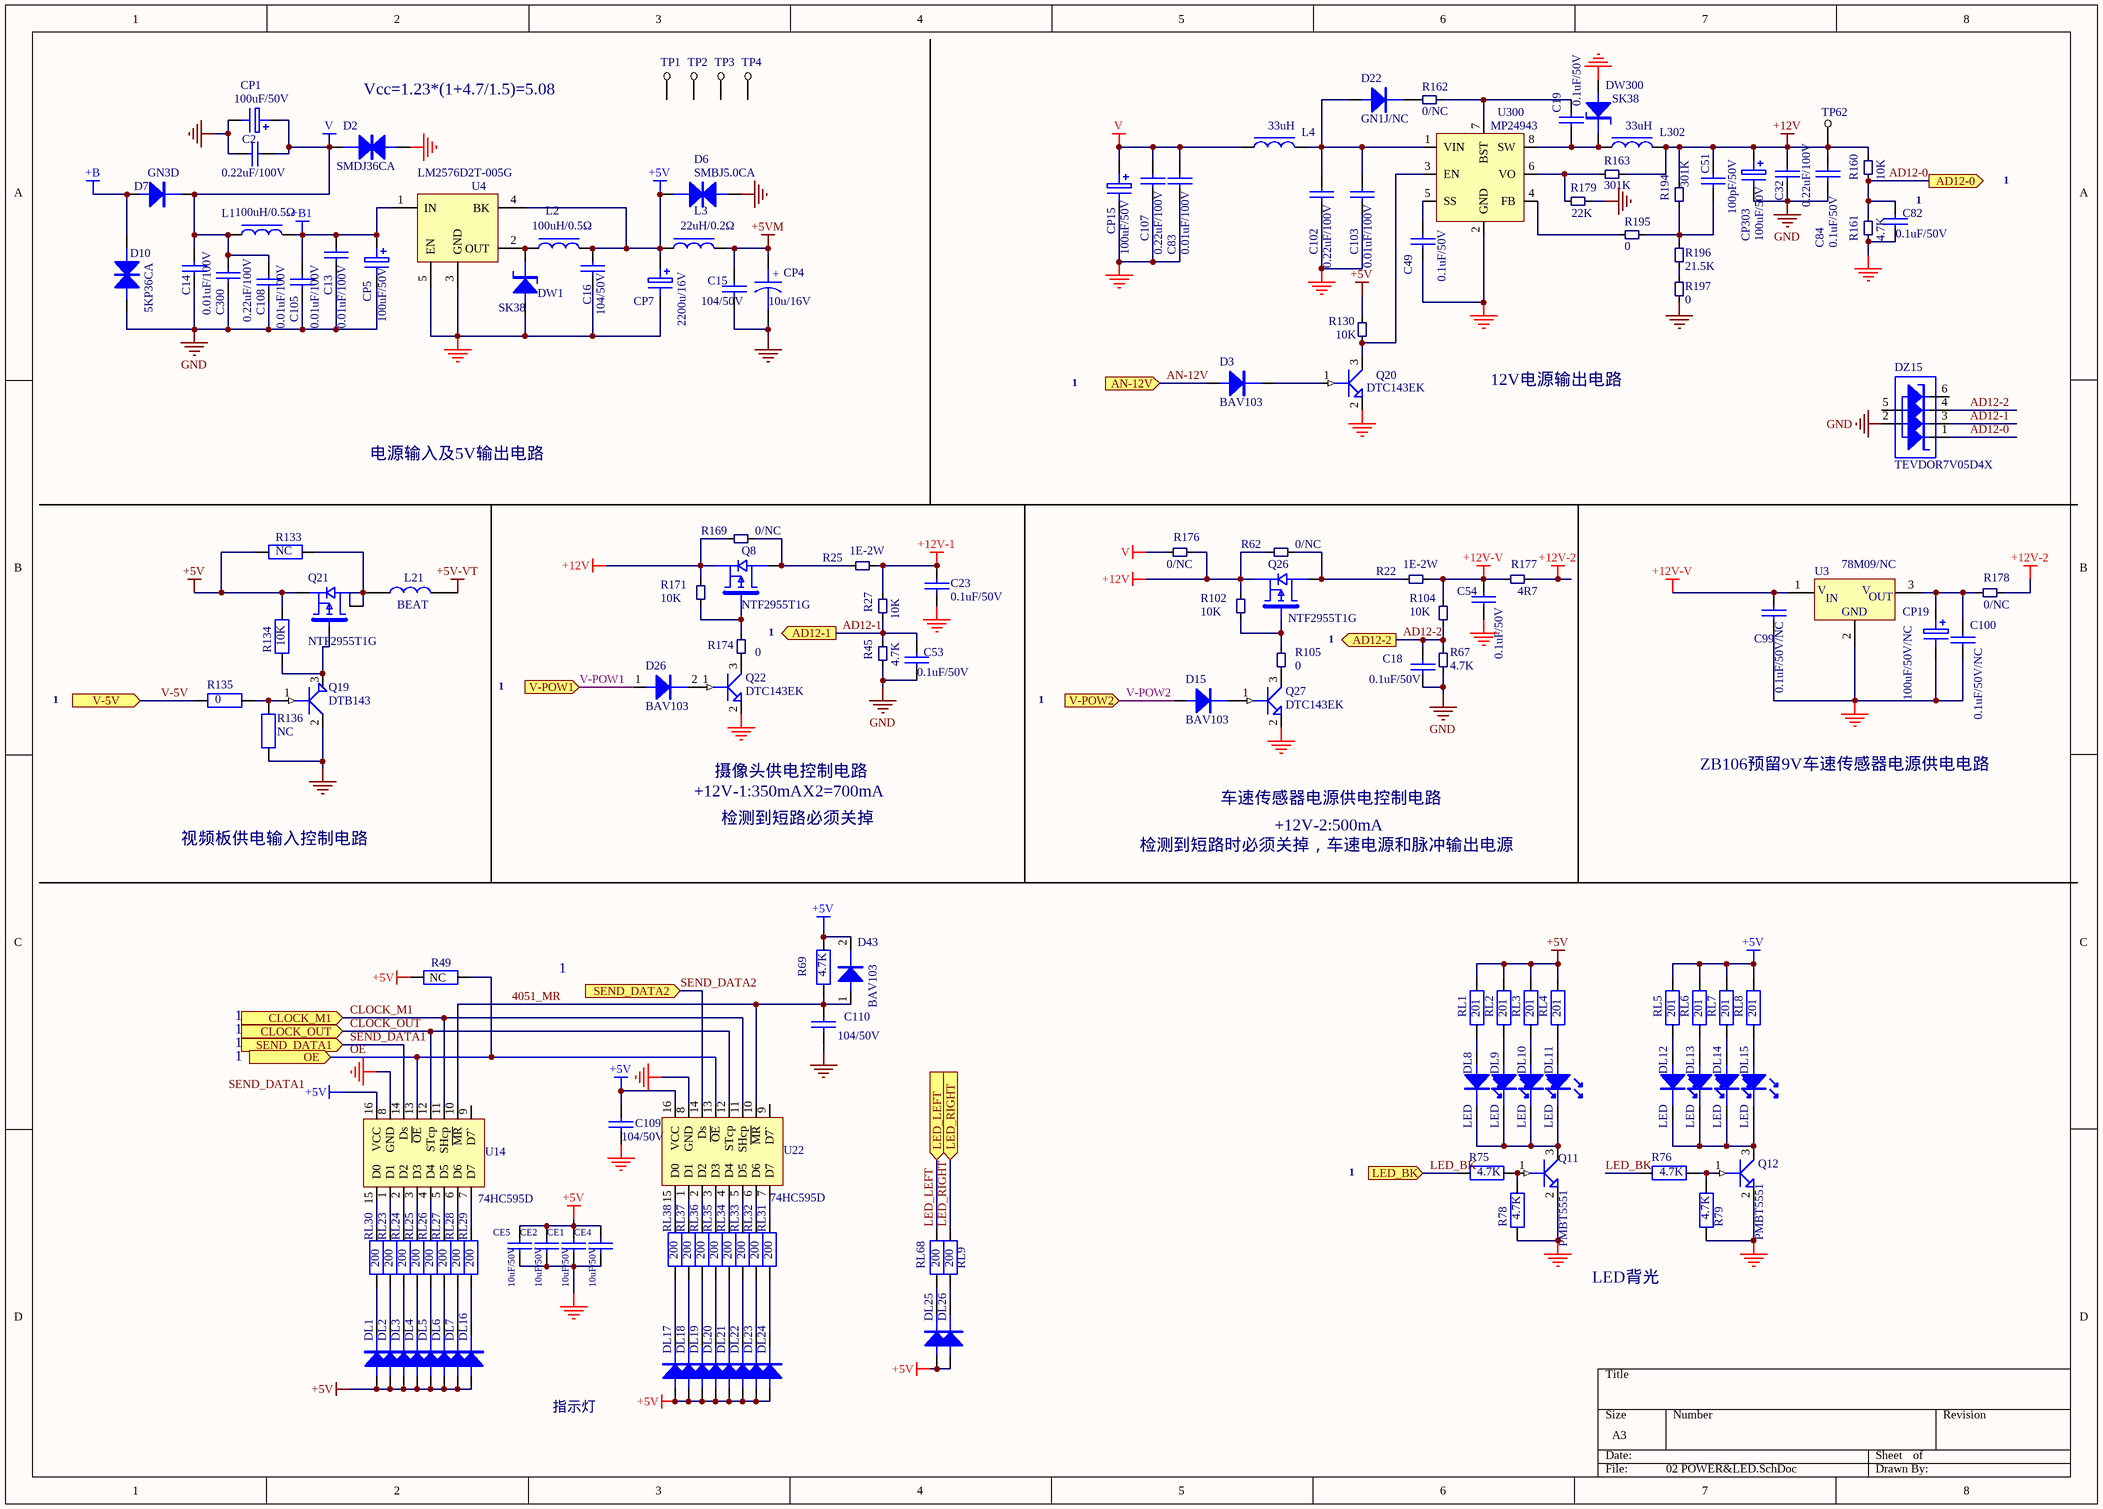
[diagram p4: 02 POWER&LED.SchDoc]

### Parts
C2  0.22uF/100V  [CR1206]
C13  0.01uF/100V  [CR0805]
C14  0.01uF/100V  [CR0805]
C15  104/50V  [CR0805]
C16  104/50V  [CR0805]
C18  0.1uF/50V  [CR0805]
C19  0.1uF/50V  [CR0805]
C23  0.1uF/50V  [CR0805]
C32  0.22uF/100V  [CR1206]
C49  0.1uF/50V  [CR0805]
C51  100pF/50V  [CR0805]
C53  0.1uF/50V  [CR0805]
C54  0.1uF/50V  [CR0805]
C82  0.1uF/50V  [CR0805]
C83  0.01uF/100V  [CR0805]
C84  0.1uF/50V  [CR0805]
C99  0.1uF/50V/NC  [CR0805]
C100  0.1uF/50V/NC  [CR0805]
C102  0.22uF/100V  [CR1206]
C103  0.01uF/100V  [CR0805]
C105  0.01uF/100V  [CR0805]
C107  0.22uF/100V  [CR1206]
C108  0.01uF/100V  [CR0805]
C109  104/50V  [CR0805]
C110  104/50V  [CR0805]
C300  0.22uF/100V  [CR1206]
CE1  10uF/50V  [CR1206]
CE2  10uF/50V  [CR1206]
CE4  10uF/50V  [CR1206]
CE5  10uF/50V  [CR1206]
CP1  100uF/50V  [RB10]
CP4  10u/16V  [CE1206]
CP5  100uF/50V  [RB5-1]
CP7  2200u/16V  [RB12.5]
CP15  100uF/50V  [RB5-1]
CP19  100uF/50V/NC  [RB5-1]
CP303  100uF/50V  [RB5-1]
D2  SMDJ36CA  [SMC-D]
D3  BAV103  [SOD-80C]
D6  SMBJ5.0CA  [SMB-D]
D7  GN3D  [SMC]
D10  5KP36CA  [D-17]
D15  BAV103  [SOD-80C]
D22  GN1J/NC  [SMA]
D26  BAV103  [SOD-80C]
D43  BAV103  [SOD-80C]
DL1  (no value)  [LED1210]
DL2  (no value)  [LED1210]
DL3  (no value)  [LED1210]
DL4  (no value)  [LED1210]
DL5  (no value)  [LED1210]
DL6  (no value)  [LED1210]
DL7  (no value)  [LED1210]
DL8  LED  [LED1210]
DL9  LED  [LED1210]
DL10  LED  [LED1210]
DL11  LED  [LED1210]
DL12  LED  [LED1210]
DL13  LED  [LED1210]
DL14  LED  [LED1210]
DL15  LED  [LED1210]
DL16  (no value)  [LED1210]
DL17  (no value)  [LED1210]
DL18  (no value)  [LED1210]
DL19  (no value)  [LED1210]
DL20  (no value)  [LED1210]
DL21  (no value)  [LED1210]
DL22  (no value)  [LED1210]
DL23  (no value)  [LED1210]
DL24  (no value)  [LED1210]
DL25  (no value)  [LED1210]
DL26  (no value)  [LED1210]
DW1  SK38  [SMC]
DW300  SK38  [SMC]
DZ15  TEVDOR7V05D4X  [SOT-457]
L1  100uH/0.5Ω  [Ind-R13-7-100]
L2  100uH/0.5Ω  [Ind-R13-7-100]
L3  22uH/0.2Ω  [SS0603]
L4  33uH  [Ind-R13-7-100]
L21  BEAT  [CR0805]
L302  33uH  [Ind-R13-7-100]
Q8  NTF2955T1G  [SOT-223]
Q11  PMBT5551  [SOT23]
Q12  PMBT5551  [SOT23]
Q19  DTB143  [SOT23]
Q20  DTC143EK  [SOT23]
Q21  NTF2955T1G  [SOT-223]
Q22  DTC143EK  [SOT23]
Q26  NTF2955T1G  [SOT-223]
Q27  DTC143EK  [SOT23]
R22  1E-2W  [R2512]
R25  1E-2W  [R2512]
R27  10K  [CR0805]
R45  4.7K  [CR0805]
R49  NC  [CR0805]
R62  0/NC  [CR1206]
R67  4.7K  [CR0805]
R69  4.7K  [CR0805]
R75  4.7K  [CR0805]
R76  4.7K  [CR0805]
R78  4.7K  [CR0805]
R79  4.7K  [CR0805]
R102  10K  [CR0805]
R104  10K  [CR0805]
R105  0  [CR0805]
R130  10K  [CR0805]
R133  NC  [CR1206]
R134  10K  [CR0805]
R135  0  [CR0805]
R136  NC  [CR0805]
R160  10K  [CR0805]
R161  4.7K  [CR0805]
R162  0/NC  [CR0805]
R163  301K  [CR0805]
R169  0/NC  [CR1206]
R171  10K  [CR0805]
R174  0  [CR0805]
R176  0/NC  [CR1206]
R177  4R7  [CR1206]
R178  0/NC  [CR1206]
R179  22K  [CR0805]
R194  301K  [CR0805]
R195  0  [CR0805]
R196  21.5K  [CR0805]
R197  0  [CR0805]
RL1  201  [CR0805]
RL2  201  [CR0805]
RL3  201  [CR0805]
RL4  201  [CR0805]
RL5  201  [CR0805]
RL6  201  [CR0805]
RL7  201  [CR0805]
RL8  201  [CR0805]
RL9  200  [CR0805]
RL23  200  [CR0805]
RL24  200  [CR0805]
RL25  200  [CR0805]
RL26  200  [CR0805]
RL27  200  [CR0805]
RL28  200  [CR0805]
RL29  200  [CR0805]
RL30  200  [CR0805]
RL31  200  [CR0805]
RL32  200  [CR0805]
RL33  200  [CR0805]
RL34  200  [CR0805]
RL35  200  [CR0805]
RL36  200  [CR0805]
RL37  200  [CR0805]
RL38  200  [CR0805]
RL68  200  [CR0805]
TP1  TP  [MARK]  (value not drawn)
TP2  TP  [MARK]  (value not drawn)
TP3  TP  [MARK]  (value not drawn)
TP4  TP  [MARK]  (value not drawn)
TP62  (no value)  [TP]
U3  78M09/NC  [DPAK]
U4  LM2576D2T-005G  [SOT-263-5]
U14  74HC595D  [SO-16]
U22  74HC595D  [SO-16]
U300  MP24943  [SOIC8E]

### Ports
AD12-0 (out), AD12-1 (out), AD12-2 (out), AN-12V (in), CLOCK_M1 (in), CLOCK_OUT (in), LED_BK (in), LED_LEFT (in), LED_RIGHT (in), OE (in), SEND_DATA1 (in), SEND_DATA2 (in), V-5V (in), V-POW1 (in), V-POW2 (in)

### Nets
+5V: C16.2 C109.2 CE1.1 CE2.1 CE4.1 CE5.1 CP7.1 D6.1 D43.2(A) DL1.1(A) DL2.1(A) DL3.1(A) DL4.1(A) DL5.1(A) DL6.1(A) DL7.1(A) DL16.1(A) DL17.1(A) DL18.1(A) DL19.1(A) DL20.1(A) DL21.1(A) DL22.1(A) DL23.1(A) DL24.1(A) DL25.1(A) DL26.1(A) L2.2 L3.1 Q21.3(S) R49.1 R69.2 R130.1 R133.1 R134.1 RL1.1 RL2.1 RL3.1 RL4.1 RL5.1 RL6.1 RL7.1 RL8.1 U4.4(BK) U14.16(VCC) U22.16(VCC)
+5V-VT: L21.2
+5VM: C15.1 CP4.1 L3.2
+12V: C32.2 C51.2 C84.2 CP303.1 L302.2 Q8.3 Q26.3 R62.1 R102.2 R160.2 R163.2 R169.1 R171.2 R176.2 R194.1 TP62.1
+12V-1: C23.1 R25.2 R27.2
+12V-2: R177.2 R178.2
+12V-V: C54.1 C99.2 R22.2 R104.2 R177.1 U3.1(VIN)
+B: D7.1(A) D10.1
+B1: C13.2 C105.2 CP5.1 L1.2 U4.1(IN)
GND: C2.1 C13.1 C14.1 C15.2 C16.1 C18.1 C23.2 C32.1 C49.1 C53.1 C54.2 C82.1 C83.1 C84.1 C99.1 C100.2 C102.1 C103.1 C105.1 C107.1 C108.1 C109.1 C110.2 C300.1 CE1.2 CE2.2 CE4.2 CE5.2 CP1.2 CP4.2 CP5.2 CP7.2 CP15.2 CP19.2 CP303.2 D2.2 D6.2 D10.2 DW1.1(A) DW300.1(A) DZ15.2 Q11.2(E) Q12.2(E) Q19.2(c) Q20.2(gnd) Q22.2(gnd) Q27.2(gnd) R45.1 R67.1 R78.2 R79.2 R136.1 R161.1 R179.1 R197.2 U3.2(GND) U4.3(GND) U4.5(EN) U14.8(GND) U22.8(GND) U300.2(GND)
V: C2.2 C14.2 C83.2 C107.2 C108.2 C300.2 CP1.1 CP15.1 D2.1 D7.2(K) L1.1 L4.1 R176.1
4051_MR: C110.1 D43.1(K) R69.1 U14.10(~{MR}) U22.10(~{MR})
AD12-0: C82.2 DZ15.1 R160.1 R161.2 ; port AD12-0
AD12-1: C53.2 DZ15.3 R27.1 R45.2 ; port AD12-1
AD12-2: C18.2 DZ15.4 R67.2 R104.1 ; port AD12-2
AN-12V: D3.1(A) ; port AN-12V
CLOCK_M1: U14.11(SHcp) U22.11(SHcp) ; port CLOCK_M1
CLOCK_OUT: U14.12(STcp) U22.12(STcp) ; port CLOCK_OUT
LED_BK: R75.1 R76.1 ; port LED_BK
LED_LEFT: RL68.1 ; port LED_LEFT
LED_RIGHT: RL9.1 ; port LED_RIGHT
OE: R49.2 U14.13(~{OE}) U22.13(~{OE}) ; port OE
SEND_DATA1: U14.14(Ds) ; port SEND_DATA1
SEND_DATA2: U22.14(Ds) ; port SEND_DATA2
V-5V: R135.1 ; port V-5V
V-POW1: D26.1(A) ; port V-POW1
V-POW2: D15.1(A) ; port V-POW2
NetC19_1: C19.1 DW300.2(K) L302.1 U300.8(SW)
NetC19_2: C19.2 R162.1 U300.7(BST)
NetC49_2: C49.2 U300.5(SS)
NetC51_1: C51.1 R194.2 R195.1 R196.1
NetC100_1: C100.1 CP19.1 R178.1 U3.3(VOUT)
NetC102_2: C102.2 C103.2 D22.1(A) L4.2 U300.1(VIN)
NetD3_2: D3.2(K) Q20.1(in)
NetD15_2: D15.2(K) Q27.1(in)
NetD22_2: D22.2(K) R162.2
NetD26_2: D26.2(K) Q22.1(in)
NetDL1_2: DL1.2(K) RL30.2
NetDL2_2: DL2.2(K) RL23.2
NetDL3_2: DL3.2(K) RL24.2
NetDL4_2: DL4.2(K) RL25.2
NetDL5_2: DL5.2(K) RL26.2
NetDL6_2: DL6.2(K) RL27.2
NetDL7_2: DL7.2(K) RL28.2
NetDL8_1: DL8.1 RL1.2
NetDL8_2: DL8.2 DL9.2 DL10.2 DL11.2 Q11.3(C)
NetDL9_1: DL9.1 RL2.2
NetDL10_1: DL10.1 RL3.2
NetDL11_1: DL11.1 RL4.2
NetDL12_1: DL12.1 RL5.2
NetDL12_2: DL12.2 DL13.2 DL14.2 DL15.2 Q12.3(C)
NetDL13_1: DL13.1 RL6.2
NetDL14_1: DL14.1 RL7.2
NetDL15_1: DL15.1 RL8.2
NetDL16_2: DL16.2(K) RL29.2
NetDL17_2: DL17.2(K) RL38.2
NetDL18_2: DL18.2(K) RL37.2
NetDL19_2: DL19.2(K) RL36.2
NetDL20_2: DL20.2(K) RL35.2
NetDL21_2: DL21.2(K) RL34.2
NetDL22_2: DL22.2(K) RL33.2
NetDL23_2: DL23.2(K) RL32.2
NetDL24_2: DL24.2(K) RL31.2
NetDL25_2: DL25.2(K) RL68.2
NetDL26_2: DL26.2(K) RL9.2
NetDW1_2: DW1.2(K) L2.1 U4.2(OUT)
NetL21_1: L21.1 Q21.2(D) Q21.4(D) R133.2
NetQ8_1: Q8.1 R171.1 R174.1
NetQ8_2: Q8.2 R25.1 R169.2
NetQ11_1: Q11.1(B) R75.2 R78.1
NetQ12_1: Q12.1(B) R76.2 R79.1
NetQ19_1: Q19.1(b) R135.2 R136.2
NetQ19_3: Q19.3(e) Q21.1(G) R134.2
NetQ20_3: Q20.3(out) R130.2 U300.3(EN)
NetQ22_3: Q22.3(out) R174.2
NetQ26_1: Q26.1 R102.1 R105.1
NetQ26_2: Q26.2 R22.1 R62.2
NetQ27_3: Q27.3(out) R105.2
NetR163_1: R163.1 R179.2 U300.6(VO)
NetR195_2: R195.2 U300.4(FB)
NetR196_2: R196.2 R197.1
NetRL23_1: RL23.1 U14.1(D1)
NetRL24_1: RL24.1 U14.2(D2)
NetRL25_1: RL25.1 U14.3(D3)
NetRL26_1: RL26.1 U14.4(D4)
NetRL27_1: RL27.1 U14.5(D5)
NetRL28_1: RL28.1 U14.6(D6)
NetRL29_1: RL29.1 U14.7(D7)
NetRL30_1: RL30.1 U14.15(D0)
NetRL31_1: RL31.1 U22.7(D7)
NetRL32_1: RL32.1 U22.6(D6)
NetRL33_1: RL33.1 U22.5(D5)
NetRL34_1: RL34.1 U22.4(D4)
NetRL35_1: RL35.1 U22.3(D3)
NetRL36_1: RL36.1 U22.2(D2)
NetRL37_1: RL37.1 U22.1(D1)
NetRL38_1: RL38.1 U22.15(D0)

Not connected (* = marked no-connect by the designer): DZ15 5 6; TP1 1; TP2 1; TP3 1; TP4 1; U14 9(D7`); U22 9(D7`)

### Notes on the sheet
- (near D2) Vcc=1.23*(1+4.7/1.5)=5.08
- 1
- (near C82) 1
- 12V电源输出电路
- 电源输入及5V输出电路
- (near Q26) 1
- 摄像头供电控制电路
- ZB106预留9V车速传感器电源供电电路
- 视频板供电输入控制电路
- +12V-1:350mAX2=700mA
- 检测到短路必须关掉
- 检测到短路时必须关掉，车速电源和脉冲输出电源
- 车速传感器电源供电控制电路
- +12V-2:500mA
- LED背光
- 指示灯
- Labels drawn without touching a wire or pin: SEND_DATA1
- (in symbol 78M12) V; IN; OUT
- (in symbol CAPACITOR POL) +

### Library data of the parts
C2 C13-C16 C18 C19 C23 C32 C49 C51 C53 C54 C82-C84 C99 C100 C102 C103 C105 C107-C110 C300 CE1 CE2 CE4 CE5 = CAP: Capacitor
CP1 CP5 CP7 CP15 CP19 CP303 = ELECTRO1: 电解电容
CP4 = CAPACITOR POL: Capacitor
D2 D6 D10 = TVS
D3 D7 D15 D22 D26 D43 = DIODE: 二极管
DL1-DL7 DL16-DL26 = DOS: 贴片二极管
DL8-DL15 = LED: 贴片LED
DW1 DW300 = DW: 稳压二极管
DZ15 = BZA456G: 二极管排
L1 L2 L4 L302 = L: 电感
L3 = L: SS0603220ML
Q8 Q26 = MOS-P: MOS
Q11 Q12 = PMBT5551: PNP   三极管; HelpURL: G:\资料\规格书\二三极管\PMBT5551.pdf
Q19 = BCX53
Q20 Q22 Q27 = DTC143: NPN; HelpURL: G:\资料\规格书\二三极管\dtc143ee.pdf
Q21 = NTF2955T1G: MOS
R22 R25 R27 R45 R62 R67 R102 R104 R105 R130 R160-R163 R169 R171 R174 R176-R179 R194-R197 = Resister mini: 贴片电阻
R49 R69 R75 R76 R78 R79 R133-R136 RL1-RL9 RL23-RL38 RL68 = RES: 贴片电阻
TP62 = TP
U3 = 78M12: IC-三端稳压
U4 = LDO_1: DC/DC
U300 = MP24943: IC-CAN DRIVER; HelpURL: G:\资料\规格书\Freescale\MCP2551.pdf

## Nets that join several sheets
+5V: 03 METER&PWM&KEY (6 pins), 04 SWITCH (15 pins), 02 POWER&LED (46 pins)
+5V-VT: 01 MCU (5 pins), 02 POWER&LED (L21.2)
+5VM: 01 MCU (51 pins), 03 METER&PWM&KEY (6 pins), 02 POWER&LED (C15.1 CP4.1 L3.2)
+12V-1: 01 MCU (JV01.4), 02 POWER&LED (C23.1 R25.2 R27.2)
+12V-2: 03 METER&PWM&KEY (6 pins), 04 SWITCH (JB1.3), 02 POWER&LED (R177.2 R178.2)
+B: 04 SWITCH (JA1.3 JA1.4), 02 POWER&LED (D7.1 D10.1)
GND: 01 MCU (137 pins), 03 METER&PWM&KEY (37 pins), 04 SWITCH (99 pins), 02 POWER&LED (61 pins)
V: 04 SWITCH (8 pins), 02 POWER&LED (13 pins)
V1: 03 METER&PWM&KEY (R17.2), 04 SWITCH (24 pins)
AD12-0: 01 MCU (U10.83), 02 POWER&LED (C82.2 DZ15.1 R160.1 R161.2)
AD12-1: 01 MCU (U10.84), 02 POWER&LED (C53.2 DZ15.3 R27.1 R45.2)
AD12-2: 01 MCU (U10.85), 02 POWER&LED (C18.2 DZ15.4 R67.2 R104.1)
AD28: 03 METER&PWM&KEY (D35.1 R143.2 R144.2), 04 SWITCH (DZ14.4 DZ14.6 U5.4)
ADC0: 01 MCU (U10.86), 04 SWITCH (U17.3)
ADC1: 01 MCU (U10.1), 04 SWITCH (U18.3)
ADC2: 01 MCU (U10.2), 04 SWITCH (U20.3)
ADC3: 01 MCU (U10.82), 04 SWITCH (U5.3)
AN-12V: 01 MCU (U10.101), 02 POWER&LED (D3.1)
AN-POW_1: 01 MCU (U10.93), 04 SWITCH (D33.1)
AN-POW_2: 01 MCU (U10.92), 04 SWITCH (D21.1)
BELL: 01 MCU (U10.113), 03 METER&PWM&KEY (Q9.2)
CAN0_H: 01 MCU (C6.2 D32.2 R5.2 U1.7), 04 SWITCH (JA1.7)
CAN0_L: 01 MCU (C11.2 D25.2 R5.1 U1.6), 04 SWITCH (JA1.5 R66.1)
CAN1_H: 01 MCU (C5.2 D40.2 R6.2 U2.7), 04 SWITCH (JA1.8)
CAN1_L: 01 MCU (C9.2 D39.2 R6.1 U2.6), 04 SWITCH (JA1.6 R151.2)
CAN_SHLD0: 01 MCU (R12.2), 04 SWITCH (JA1.9)
CAN_SHLD1: 01 MCU (R13.2), 04 SWITCH (JA1.10)
CLOCK_M1: 01 MCU (U10.105), 02 POWER&LED (U14.11 U22.11)
CLOCK_OUT: 01 MCU (U10.106), 02 POWER&LED (U14.12 U22.12)
CP1: 01 MCU (U10.139), 03 METER&PWM&KEY (R96.2)
DA1: 01 MCU (U10.110), 04 SWITCH (U17.11)
DA2: 01 MCU (U10.140), 04 SWITCH (U18.11)
DA3: 01 MCU (U10.39), 04 SWITCH (U20.11)
DA4: 01 MCU (U10.99), 04 SWITCH (U5.11)
DB1: 01 MCU (U10.111), 04 SWITCH (U17.10)
DB2: 01 MCU (U10.141), 04 SWITCH (U18.10)
DB3: 01 MCU (U10.38), 04 SWITCH (U20.10)
DB4: 01 MCU (U10.95), 04 SWITCH (U5.10)
DC1: 01 MCU (U10.112), 04 SWITCH (U17.9)
DC2: 01 MCU (U10.142), 04 SWITCH (U18.9)
DC3: 01 MCU (U10.37), 04 SWITCH (U20.9)
DC4: 01 MCU (U10.94), 04 SWITCH (U5.9)
F49: 03 METER&PWM&KEY (D13.2), 04 SWITCH (JB1.1)
LED_BK: 01 MCU (U10.8), 02 POWER&LED (R75.1 R76.1)
LED_LEFT: 01 MCU (U10.102), 02 POWER&LED (RL68.1)
LED_RIGHT: 01 MCU (U10.103), 02 POWER&LED (RL9.1)
METER1_1: 01 MCU (RP11.5), 03 METER&PWM&KEY (M1.1)
METER1_2: 01 MCU (RP11.6), 03 METER&PWM&KEY (M1.2)
METER1_3: 01 MCU (RP11.7), 03 METER&PWM&KEY (M1.3)
METER1_4: 01 MCU (RP11.8), 03 METER&PWM&KEY (M1.4)
METER2_1: 01 MCU (RP12.5), 03 METER&PWM&KEY (M2.1)
METER2_2: 01 MCU (RP12.6), 03 METER&PWM&KEY (M2.2)
METER2_3: 01 MCU (RP12.7), 03 METER&PWM&KEY (M2.3)
METER2_4: 01 MCU (RP12.8), 03 METER&PWM&KEY (M2.4)
OE: 01 MCU (U10.107), 02 POWER&LED (R49.2 U14.13 U22.13)
PWM1: 01 MCU (U10.7), 03 METER&PWM&KEY (D16.1)
PWMOUT1: 03 METER&PWM&KEY (5 pins), 04 SWITCH (JA1.27)
SEND_DATA1: 01 MCU (U10.108), 02 POWER&LED (U14.14)
SEND_DATA2: 01 MCU (U10.109), 02 POWER&LED (U22.14)
SW101: 01 MCU (U10.36), 03 METER&PWM&KEY (C55.2 DZ12.6 R11.2 SW1.1)
SW102: 01 MCU (U10.35), 03 METER&PWM&KEY (C20.2 DZ12.4 R15.2 SW2.1)
SW103: 01 MCU (U10.24), 03 METER&PWM&KEY (C50.2 DZ12.3 R56.2 SW3.1)
SW104: 01 MCU (U10.23), 03 METER&PWM&KEY (C88.2 DZ9.4 R73.1 SW4.1)
SW105: 01 MCU (U10.22), 03 METER&PWM&KEY (C38.1 DZ9.3 R42.1 SW5.1)
SW106: 01 MCU (U10.21), 03 METER&PWM&KEY (C35.2 DZ9.1 R31.1 SW6.1)
V-5V: 01 MCU (U10.90), 02 POWER&LED (R135.1)
V-POW: 01 MCU (U10.91), 04 SWITCH (D12.1)
V-POW1: 01 MCU (U10.100), 02 POWER&LED (D26.1)
V-POW2: 01 MCU (U10.104), 02 POWER&LED (D15.1)